# EAGLE design SparkFun_Thing_Plus_RP2350 (EAGLE 9.6.2)
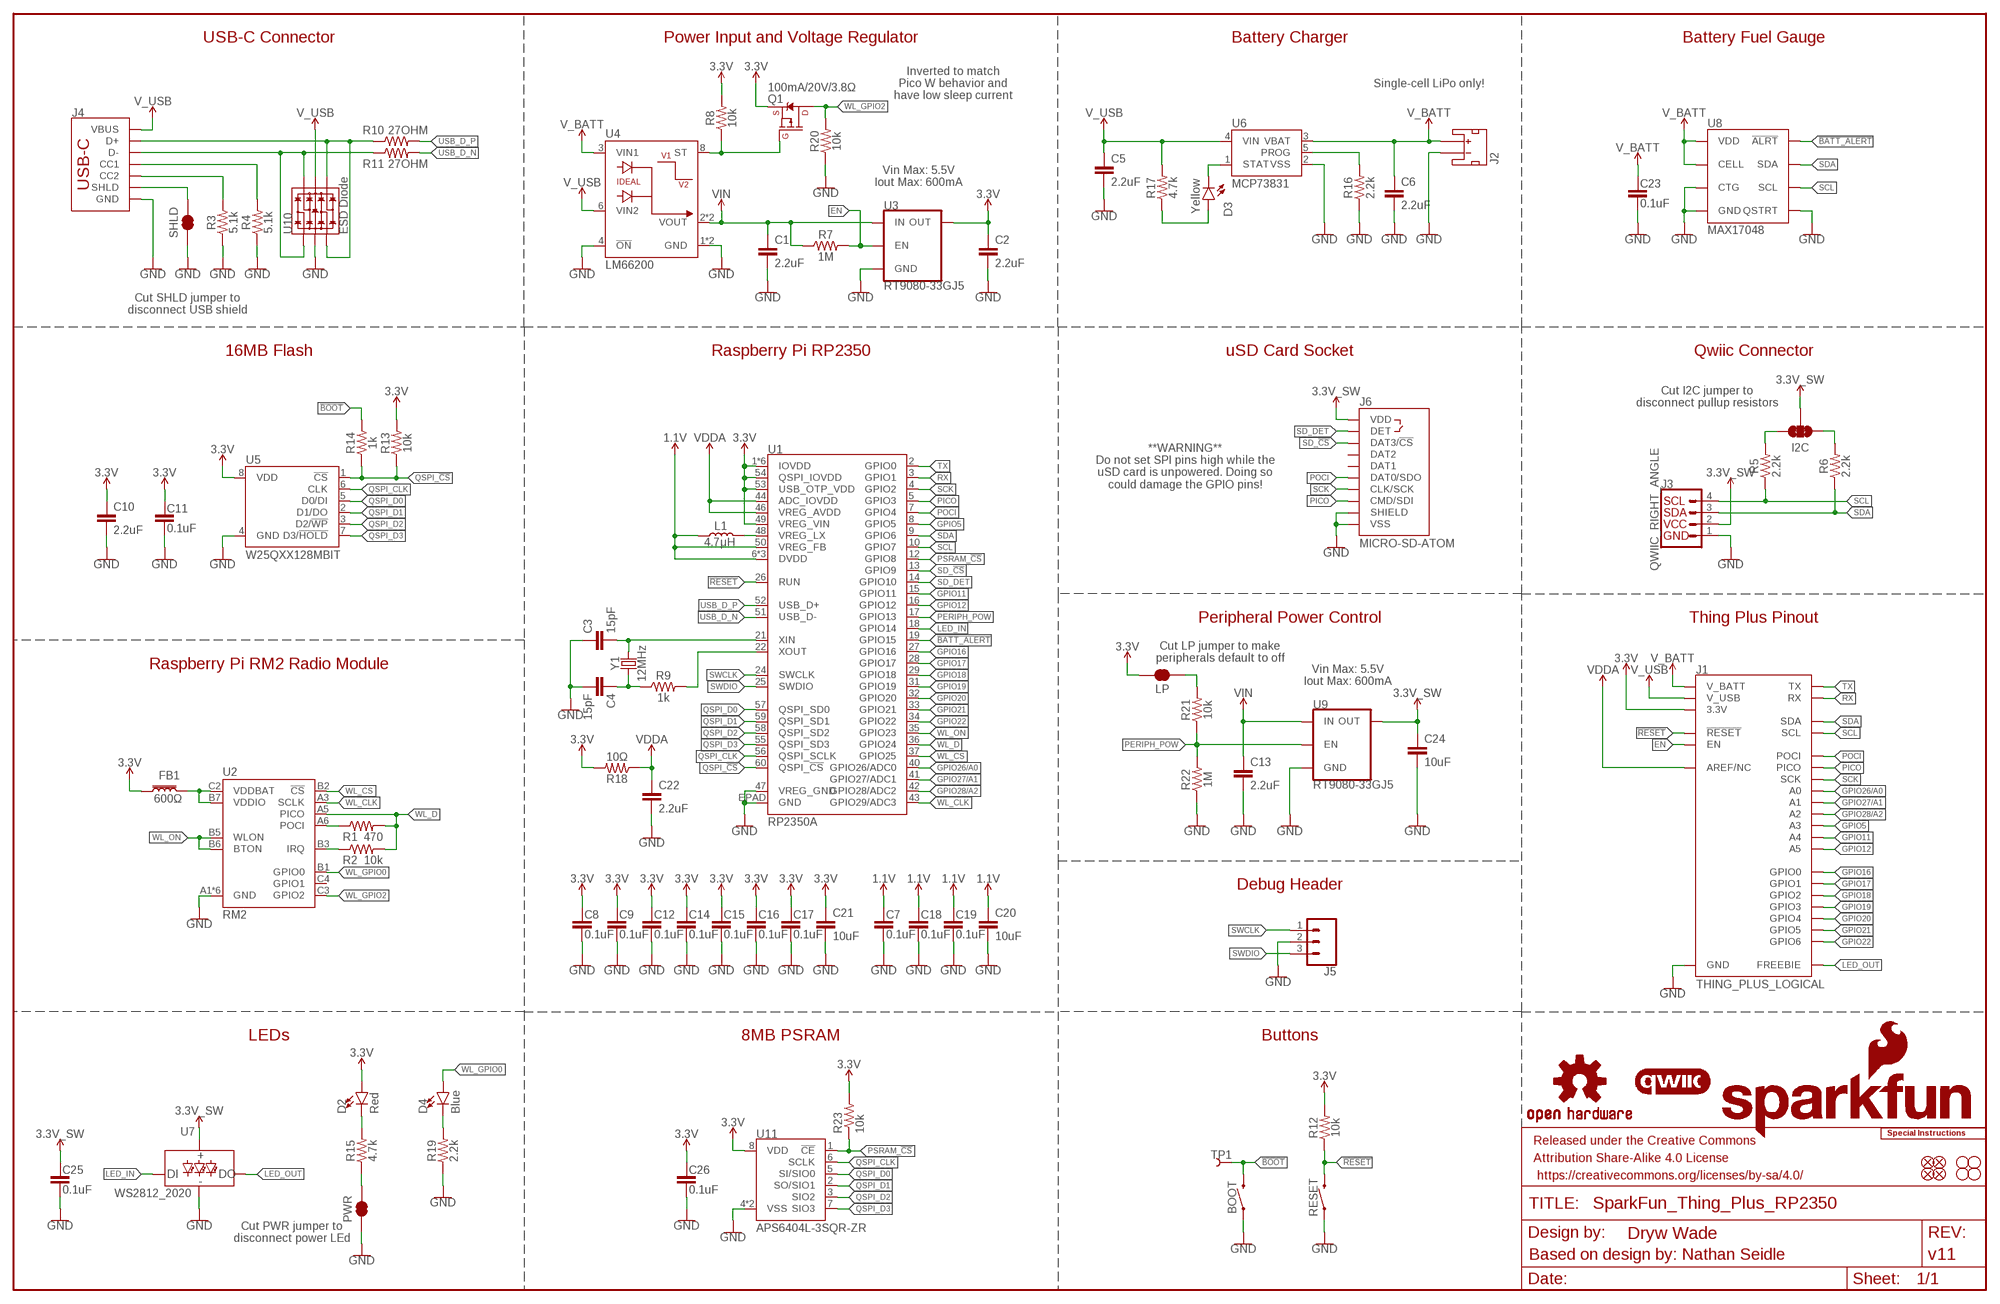
[diagram p0: schematic, sheet 1]

## Parts
BOOT  MOMENTARY-SWITCH-SPST-SMD-4.6X2.8MM  [TACTILE_SWITCH_SMD_4.6X2.8MM]
C1  2.2uF  2.2UF-0402_TIGHT-10V-10%-X5R  [0402-TIGHT]
C2  2.2uF  2.2UF-0402_TIGHT-10V-10%-X5R  [0402-TIGHT]
C3  15pF  15PF-0402T-50V-5%  [0402-TIGHT]
C4  15pF  15PF-0402T-50V-5%  [0402-TIGHT]
C5  2.2uF  2.2UF-0402_TIGHT-10V-10%-X5R  [0402-TIGHT]
C6  2.2uF  2.2UF-0402_TIGHT-10V-10%-X5R  [0402-TIGHT]
C7  0.1uF  0.1UF-0402T-6.3V-10%-X7R  [0402-TIGHT]
C8  0.1uF  0.1UF-0402T-6.3V-10%-X7R  [0402-TIGHT]
C9  0.1uF  0.1UF-0402T-6.3V-10%-X7R  [0402-TIGHT]
C10  2.2uF  2.2UF-0402_TIGHT-10V-10%-X5R  [0402-TIGHT]
C11  0.1uF  0.1UF-0402T-6.3V-10%-X7R  [0402-TIGHT]
C12  0.1uF  0.1UF-0402T-6.3V-10%-X7R  [0402-TIGHT]
C13  2.2uF  2.2UF-0402_TIGHT-10V-10%-X5R  [0402-TIGHT]
C14  0.1uF  0.1UF-0402T-6.3V-10%-X7R  [0402-TIGHT]
C15  0.1uF  0.1UF-0402T-6.3V-10%-X7R  [0402-TIGHT]
C16  0.1uF  0.1UF-0402T-6.3V-10%-X7R  [0402-TIGHT]
C17  0.1uF  0.1UF-0402T-6.3V-10%-X7R  [0402-TIGHT]
C18  0.1uF  0.1UF-0402T-6.3V-10%-X7R  [0402-TIGHT]
C19  0.1uF  0.1UF-0402T-6.3V-10%-X7R  [0402-TIGHT]
C20  10uF  10UF-0402T-6.3V-20%  [0402-TIGHT]
C21  10uF  10UF-0402T-6.3V-20%  [0402-TIGHT]
C22  2.2uF  2.2UF-0402_TIGHT-10V-10%-X5R  [0402-TIGHT]
C23  0.1uF  0.1UF-0402T-6.3V-10%-X7R  [0402-TIGHT]
C24  10uF  10UF-0402T-6.3V-20%  [0402-TIGHT]
C25  0.1uF  0.1UF-0402T-6.3V-10%-X7R  [0402-TIGHT]
C26  0.1uF  0.1UF-0402T-6.3V-10%-X7R  [0402-TIGHT]
D2  Red  LED-RED_0603-KB  [LED-0603]
D3  Yellow  LED-YELLOW0603  [LED-0603]
D4  Blue  LED-BLUE0603  [LED-0603]
FB1  600Ω  FERRITE_BEAD-0805-600Ω-100MHZ  [0805]
FD1  FIDUCIALUFIDUCIAL  [FIDUCIAL-MICRO]
FD2  FIDUCIALUFIDUCIAL  [FIDUCIAL-MICRO]
FD3  FIDUCIALUFIDUCIAL  [FIDUCIAL-MICRO]
FD4  FIDUCIALUFIDUCIAL  [FIDUCIAL-MICRO]
FRAME1  FRAME-LEDGER  [CREATIVE_COMMONS]
H1  STAND-OFF  [STAND-OFF]
H2  STAND-OFF  [STAND-OFF]
H3  STAND-OFF  [STAND-OFF]
H4  STAND-OFF  [STAND-OFF]
I2C  JUMPER-SMT_3_2-NC_TRACE_SILK  [SMT-JUMPER_3_2-NC_TRACE_SILK]
J1  THING_PLUS_LOGICAL  [THING_PLUS]
J2  JST_2MM_MALE  [JST-2-SMD]
J3  QWIIC_RIGHT_ANGLE  QWIIC_CONNECTORJS-1MM  [JST04_1MM_RA]
J4  USB_C_4-LAYER_PADS  [USB-C-16P_4LAYER-PADS]
J5  CONN_031X03_NO_SILK  [1X03_NO_SILK]
J6  MICRO-SD-ATOM  [MICROSD_ATOM]
L1  4.7μH  4.7μH_SHIELDED_INDUCTOR  [1008(2520)]
LOGO1  SFE_LOGO_NAME_FLAME.1_INCH  [SFE_LOGO_NAME_FLAME_.1]
LOGO2  OSHW-LOGOS  [OSHW-LOGO-S]
LOGO3  QWIIC_LOGO_4MM  [QWIIC_4MM]
LOGO5  SPECIAL_INSTRUCTIONS-ORDERING  [ORDERING_INSTRUCTIONS]
LP  JUMPER-SMT_2_NC_TRACE_SILK  [SMT-JUMPER_2_NC_TRACE_SILK]
PWR  JUMPER-SMT_2_NC_TRACE_SILK  [SMT-JUMPER_2_NC_TRACE_SILK]
Q1  100mA/20V/3.8Ω  MOSFET_PCH-RE1C001ZPTL  [SOT-416FL]
R1  470  470OHM-0402-TIGHT-1/16W-1%  [0402-TIGHT]
R2  10k  10KOHM-0402T-1/16W-1%  [0402-TIGHT]
R3  5.1k  5.1KOHM-0402T-1/16W-1%  [0402-TIGHT]
R4  5.1k  5.1KOHM-0402T-1/16W-1%  [0402-TIGHT]
R5  2.2k  2.2KOHM-0402T-1/16W-1%  [0402-TIGHT]
R6  2.2k  2.2KOHM-0402T-1/16W-1%  [0402-TIGHT]
R7  1M  1MOHM-0402T-1/16W-5%  [0402-TIGHT]
R8  10k  10KOHM-0402T-1/16W-1%  [0402-TIGHT]
R9  1k  1KOHM-0402T-1/16W-1%  [0402-TIGHT]
R10  27OHM  [0402-TIGHT]
R11  27OHM  [0402-TIGHT]
R12  10k  10KOHM-0402T-1/16W-1%  [0402-TIGHT]
R13  10k  10KOHM-0402T-1/16W-1%  [0402-TIGHT]
R14  1k  1KOHM-0402T-1/16W-1%  [0402-TIGHT]
R15  4.7k  4.7KOHM-0402T-1/16W-1%  [0402-TIGHT]
R16  2.2k  2.2KOHM-0402T-1/16W-1%  [0402-TIGHT]
R17  4.7k  4.7KOHM-0402T-1/16W-1%  [0402-TIGHT]
R18  10Ω  10OHM-0402-1/16W-5%  [0402-TIGHT]
R19  2.2k  2.2KOHM-0402T-1/16W-1%  [0402-TIGHT]
R20  10k  10KOHM-0402T-1/16W-1%  [0402-TIGHT]
R21  10k  10KOHM-0402T-1/16W-1%  [0402-TIGHT]
R22  1M  1MOHM-0402T-1/16W-5%  [0402-TIGHT]
R23  10k  10KOHM-0402T-1/16W-1%  [0402-TIGHT]
RESET  MOMENTARY-SWITCH-SPST-SMD-4.6X2.8MM  [TACTILE_SWITCH_SMD_4.6X2.8MM]
SHLD  JUMPER-SMT_2_NC_TRACE_SILK  [SMT-JUMPER_2_NC_TRACE_SILK]
TP1  TEST-POINT3X5  [PAD.03X.05]
U1  RP2350A  [RP2350A]
U2  RM2  [RM2]
U3  RT9080-33GJ5  V_REG_RT9080-33GJ5  [SOT23-5]
U4  LM66200  IDEAL_DIODE_DUAL_LM66200  [SOT8]
U5  W25QXX128MBIT  W25QXX128MBIT-6X5-SKINNY_CENTER  [WSON-8-6X5-SKINNY_CENTERPAD]
U6  MCP73831  [SOT23-5]
U7  WS2812_2020  [WS2812-2020]
U8  MAX17048  MAX17048DFN8  [DFN-8]
U9  RT9080-33GJ5  V_REG_RT9080-33GJ5  [SOT23-5]
U10  ESD Diode  TVS_DIODE_ARRAY_DT1042-04SO-7  [SOT-23-6]
U11  APS6404L-3SQR-ZR  [APS6404L-3SQR-ZR]
Y1  12MHz  CRYSTAL-12MHZ  [CRYSTAL-SMD-2X2.5MM]

## Nets
1.1V: C7.1 C18.1 C19.1 C20.1 L1.1 U1.6(DVDD) U1.23(DVDD) U1.39(DVDD) U1.50(VREG_FB)
3.3V: C2.1 C8.1 C9.1 C10.1 C11.1 C12.1 C14.1 C15.1 C16.1 C17.1 C21.1 C26.1 D2.A FB1.1 J1.27(3.3V) LP.2 Q1.2(S) R8.2 R12.2 R13.2 R18.2 R23.2 U1.1(IOVDD) U1.11(IOVDD) U1.20(IOVDD) U1.30(IOVDD) U1.38(IOVDD) U1.45(IOVDD) U1.49(VREG_VIN) U1.53(USB_OTP_VDD) U1.54(QSPI_IOVDD) U3.5(OUT) U5.8(VDD) U11.8(VDD)
3.3V_SW: C24.1 C25.1 I2C.2 J3.2 J6.4(VDD) U7.VCC U9.5(OUT)
!BATT_ALERT!: U1.19(GPIO15) U8.5(!ALRT)
!BOOT!: BOOT.3 BOOT.4 R14.2 TP1.1
!RESET!: J1.28(!RESET) R12.1 RESET.3 RESET.4 U1.26(RUN)
BAT_SW: Q1.1(G) R8.1 U4.8(ST)
EN: J1.11(EN) R7.2 U3.3(EN)
GND: BOOT.1 BOOT.2 C1.2 C2.2 C3.1 C4.2 C5.2 C6.2 C7.2 C8.2 C9.2 C10.2 C11.2 C12.2 C13.2 C14.2 C15.2 C16.2 C17.2 C18.2 C19.2 C20.2 C21.2 C22.2 C23.2 C24.2 C25.2 C26.2 J1.25(GND) J2.1(-) J3.1 J4.GND J4.GND2(GND) J5.2 J6.6(VSS) J6.SHIELD1(SHIELD) J6.SHIELD2(SHIELD) J6.SHIELD3(SHIELD) J6.SHIELD4(SHIELD) PWR.1 R3.1 R4.1 R16.1 R19.1 R20.1 R22.1 RESET.1 RESET.2 SHLD.1 U1.47(VREG_GND) U1.EPAD(GND) U2.A1(GND) U2.A4(GND) U2.A7(GND) U2.B4(GND) U2.C1(GND) U2.C7(GND) U3.2(GND) U4.1(GND) U4.4(!ON!) U4.5(GND) U5.4(GND) U6.2(VSS) U7.GND U8.1(CTG) U8.4(GND) U8.6(QSTRT) U8.9(GND) U9.2(GND) U10.2(VSS) U11.4(VSS) U11.9(VSS)
GPIO5: J1.21(A3) U1.8(GPIO5)
GPIO11: J1.20(A4) U1.15(GPIO11)
GPIO12: J1.19(A5) U1.16(GPIO12)
GPIO16: J1.9(GPIO0) U1.27(GPIO16)
GPIO17: J1.8(GPIO1) U1.28(GPIO17)
GPIO18: J1.7(GPIO2) U1.29(GPIO18)
GPIO19: J1.6(GPIO3) U1.31(GPIO19)
GPIO20: J1.5(GPIO4) U1.32(GPIO20)
GPIO21: J1.4(GPIO5) U1.33(GPIO21)
GPIO22: J1.3(GPIO6) U1.34(GPIO22)
GPIO26/A0: J1.24(A0) U1.40(GPIO26/ADC0)
GPIO27/A1: J1.23(A1) U1.41(GPIO27/ADC1)
GPIO28/A2: J1.22(A2) U1.42(GPIO28/ADC2)
LED_IN: U1.18(GPIO14) U7.DI
LED_OUT: J1.13(FREEBIE) U7.DO
N$1: FB1.2 U2.B7(VDDIO) U2.C2(VDDBAT)
N$2: R1.1 U2.A6(POCI)
N$3: R2.1 U2.B3(IRQ)
N$4: D4.C R19.2
N$5: J4.B5(CC2) R3.2
N$6: J4.A5(CC1) R4.2
N$7: J4.A7(D-) J4.B7(D-) R11.1 U10.1(IO1) U10.6(IO4)
N$8: J4.A6(D+) J4.B6(D+) R10.1 U10.3(IO2) U10.4(IO3)
N$9: I2C.3 R5.2
N$10: I2C.1 R6.2
N$11: LP.1 R21.2
N$13: C3.2 U1.21(XIN) Y1.P3
N$14: C4.1 R9.1 Y1.P1
N$15: R9.2 U1.22(XOUT)
N$18: D2.C R15.2
N$19: PWR.2 R15.1
N$20: R16.2 U6.5(PROG)
N$21: D3.A R17.1
N$22: D3.C U6.1(STAT)
N$23: L1.2 U1.48(VREG_LX)
PERIPH_POW: R21.1 R22.2 U1.17(GPIO13) U9.3(EN)
PICO: J1.17(PICO) J6.3(CMD/SDI) U1.5(GPIO3)
POCI: J1.16(POCI) J6.7(DAT0/SDO) U1.7(GPIO4)
PSRAM_!CS!: R23.1 U1.12(GPIO8) U11.1(!CE!)
QSPI_!CS!: R13.1 R14.1 U1.60(QSPI_!CS!) U5.1(!CS!)
QSPI_CLK: U1.56(QSPI_SCLK) U5.6(CLK) U11.6(SCLK)
QSPI_D0: U1.57(QSPI_SD0) U5.5(D0/DI) U11.5(SI/SIO0)
QSPI_D1: U1.59(QSPI_SD1) U5.2(D1/DO) U11.2(SO/SIO1)
QSPI_D2: U1.58(QSPI_SD2) U5.3(D2/!WP!) U11.3(SIO2)
QSPI_D3: U1.55(QSPI_SD3) U5.7(D3/!HOLD!) U11.7(SIO3)
RX: J1.15(RX) U1.3(GPIO1)
SCK: J1.18(SCK) J6.5(CLK/SCK) U1.4(GPIO2)
SCL: J1.2(SCL) J3.4 R5.1 U1.10(GPIO7) U8.7(SCL)
SD_!CS!: J6.2(DAT3/!CS!) U1.13(GPIO9)
SD_DET: J6.9(DET) U1.14(GPIO10)
SDA: J1.1(SDA) J3.3 R6.1 U1.9(GPIO6) U8.8(SDA)
SHLD: J4.SHLD1(SHLD) J4.SHLD2(SHLD) J4.SHLD3(SHLD) J4.SHLD4(SHLD) SHLD.2
SWCLK: J5.1 U1.24(SWCLK)
SWDIO: J5.3 U1.25(SWDIO)
TX: J1.14(TX) U1.2(GPIO0)
USB_D_N [USB]: R11.2 U1.51(USB_D-)
USB_D_P [USB]: R10.2 U1.52(USB_D+)
V_BATT: C6.1 C23.1 J1.12(V_BATT) J2.2(+) U4.3(VIN1) U6.3(VBAT) U8.2(CELL) U8.3(VDD)
V_USB: C5.1 J1.10(V_USB) J4.VBUS1(VBUS) J4.VBUS2(VBUS) R17.2 U4.6(VIN2) U6.4(VIN) U10.5(VCC)
VDDA: C22.1 J1.26(AREF/NC) R18.1 U1.44(ADC_IOVDD) U1.46(VREG_AVDD)
VIN: C1.1 C13.1 R7.1 U3.1(IN) U4.2(VOUT) U4.7(VOUT) U9.1(IN)
WL_CLK: U1.43(GPIO29/ADC3) U2.A3(SCLK)
WL_CS: U1.37(GPIO25) U2.B2(!CS!)
WL_D: R1.2 R2.2 U1.36(GPIO24) U2.A5(PICO)
WL_GPIO0: D4.A U2.B1(GPIO0)
WL_GPIO2: Q1.3(D) R20.2 U2.C3(GPIO2)
WL_ON: U1.35(GPIO23) U2.B5(WLON) U2.B6(BTON)
Unconnected: J2.NC1(PAD1) J2.NC2(PAD2) J6.1(DAT2) J6.8(DAT1) U2.C4(GPIO1)

## Notes on the sheet
- USB-C Connector | Power Input and Voltage Regulator | Battery Charger | Battery Fuel Gauge
- Inverted to match
  Pico W behavior and
  have low sleep current
- Single-cell LiPo only!
- Vin Max: 5.5V
  Iout Max: 600mA
- Cut SHLD jumper to
  disconnect USB shield
- 16MB Flash | Raspberry Pi RP2350 | uSD Card Socket | Qwiic Connector
- Cut I2C jumper to
  disconnect pullup resistors
- **WARNING**
  Do not set SPI pins high while the
  uSD card is unpowered. Doing so
  could damage the GPIO pins!
- Peripheral Power Control | Thing Plus Pinout
- Cut LP jumper to make
  peripherals default to off
- Raspberry Pi RM2 Radio Module
- Vin Max: 5.5V
  Iout Max: 600mA
- Debug Header
- LEDs | 8MB PSRAM | Buttons
- Cut PWR jumper to
  disconnect power LEd
- Based on design by: Nathan Seidle

## Library data of the parts
BOOT RESET = SparkFun-Switches:MOMENTARY-SWITCH-SPST: Momentary Switch (Pushbutton) - SPST Normally-open (NO) SPST momentary switches (buttons, pushbuttons). Variants PTH-12MM - 12mm square, through-hole Momentary Pushbutton Switch - 12mm Square <https://www.sparkfun.com/products/9190> (COM-09190) PTH-6.0MM, PTH-6.0MM-KIT - 6.0mm square, through-hole Mini Pushbutton Switch <https://www.sparkfun.com/products/97> (COM-00097) KIT package intended for soldering kit's - only one side of pads' copper is exposed. PTH-RIGHT-ANGLE-KIT - Right-angle, through-hole Right Angle Tactile Button <https://www.sparkfun.com/products/10791> - Used on SparkFun BigTime Watch Kit <https://www.sparkfun.com/products/11734> SMD-12MM - 12mm square, surface-mount Tactile Button - SMD (12mm) <https://www.sparkfun.com/products/12993> (COM-12993) Used on SparkFun PicoBoard <https://www.sparkfun.com/products/11888> SMD-4.5MM - 4.5mm Square Trackball Switch Used on SparkFun Blackberry Trackballer Breakout <https://www.sparkfun.com/products/13169> SMD-4.6MMX2.8MM - 4.60mm x 2.80mm, surface mount Used on SparkFun Thing Plus - RP2040 <https://www.sparkfun.com/products/17717> SMD-5.2MM, SMD-5.2-REDUNDANT - 5.2mm square, surface-mount Mini Pushbutton Switch - SMD <https://www.sparkfun.com/products/8720> (COM-08720) Used on Arduino Pro Mini <https://www.sparkfun.com/products/11114> REDUNDANT package connects both switch circuits together SMD-6.0X3.5MM - 6.0 x 3.5mm, surface mount Momentary Reset Switch SMD <https://www.sparkfun.com/products/8229> (COM-08229) SMD-6.2MM-TALL - 6.2mm square, surface mount Tactile Button - SMD (6mm) <https://www.sparkfun.com/products/12992> Used on SparkFun Digital Sandbox <https://www.sparkfun.com/products/12651> SMD-RIGHT-ANGLE - Right-angle, surface mount Used on SparkFun Block for Intel® Edison - Arduino <https://www.sparkfun.com/products/13036>; PROD_ID: SWCH-15606
C1 C2 C5 C6 C10 C13 C22 = SparkFun-Capacitors:2.2UF: 2.2µF ceramic capacitors A capacitor is a passive two-terminal electrical component used to store electrical energy temporarily in an electric field.; PROD_ID: CAP-14232
C3 C4 = SparkFun-Capacitors:15PF: 15pF ceramic capacitors A capacitor is a passive two-terminal electrical component used to store electrical energy temporarily in an electric field.; PROD_ID: CAP-13063
C7-C9 C11 C12 C14-C19 C23 C25 C26 = SparkFun-Capacitors:0.1UF: 0.1µF ceramic capacitors A capacitor is a passive two-terminal electrical component used to store electrical energy temporarily in an electric field.; PROD_ID: CAP-14993
C20 C21 C24 = SparkFun-Capacitors:10UF: 10.0µF ceramic capacitors A capacitor is a passive two-terminal electrical component used to store electrical energy temporarily in an electric field.; PROD_ID: CAP-14848
D2 = SparkFun-LED:LED-RED: Red SMD LED Used in manufacturing of most products at SparkFun Packages: 0603 - KB - KingBright (DIO-17976) SMD 0603 package [Datasheet] <https://www.kingbrightusa.com/images/catalog/SPEC/APT1608SURCK.pdf> 0603 - (DIO-00819, has gone EOL) SMD 0603 package 0603 SMART - SMD 0603 SMART package ( more efficient and expensive)[Product Link] <http://www.osram-os.com/Graphics/XPic2/00077099_0.pdf> 1206 - SMD1206 package [Product Link] <https://www.sparkfun.com/datasheets/DevTools/LilyPad/Q150OVS4.pdff> SparkFun Products: Pro Mini 328 -5V <https://www.sparkfun.com/products/821> RedBoard <https://www.sparkfun.com/products/12757> IOIO-OTG <https://www.sparkfun.com/products/13613>; PROD_ID: DIO-17976
D3 = SparkFun-LED:LED-YELLOW: Yellow SMD LED Used in manufacturing several products at SparkFun. Packages: 0603 - SMD 0603 package[Product Link] <http://www.kingbrightusa.com/product.asp?catalog_name=LED&product_id=APT1608SYCK> 0603 -SMART - SMART SMD 0603 package (more efficient/more expensive) [Product Link] <http://www.osram-os.com/osram_os/en/products/product-catalog/led-light-emitting-diodes/smartled-0603/ly-l29k/index.jsp> LilyPad - SMD1206 package[Product Datasheet] <https://www.sparkfun.com/datasheets/DevTools/LilyPad/Q150YUS4.pdf> SparkFun Products: Blynk Board <https://www.sparkfun.com/products/13794> IOIO-OTG <https://www.sparkfun.com/products/13613> XBee Explorer Serial <https://www.sparkfun.com/products/13225>; PROD_ID: DIO-09003
D4 = SparkFun-LED:LED-BLUE: Blue SMD LED Used in manufacturing of various products at SparkFun Packages: 0603 - SMD 0603 package [Product Link] <http://www.digikey.com/product-detail/en/SMLE12BC7TT86/511-1589-2-ND/1641808> 1206 - SMD1206 package [Product Link] <http://www.digikey.com/product-detail/en/lite-on-inc/LTST-C150TBKT/160-1643-1-ND/573584> SparkFun Products: ESP8266 Thing-Dev Board <https://www.sparkfun.com/products/13711> RedBoard <https://www.sparkfun.com/products/12757>; PROD_ID: DIO-08575
FB1 = SparkFun-Coils:FERRITE_BEAD: Ferrite Bead (blocks, cores, rings, chokes, etc.) Inductor with layers of ferrite used to suppress high frequencies. Often used to isolate high frequency noise. SparkFun Products: IOIO-OTG - V2.2 <https://www.sparkfun.com/products/13613> SparkFun SAMD21 Mini Breakout <https://www.sparkfun.com/products/13664> SparkFun 6 Degrees of Freedom Breakout - LSM6DS3 <https://www.sparkfun.com/products/13339> SparkFun SAMD21 Dev Breakout <https://www.sparkfun.com/products/13672> Lilypad MP3 <https://www.sparkfun.com/products/11013>; PROD_ID: NDUC-14988
FD1-FD4 = SparkFun-Aesthetics:FIDUCIAL: Fiducial Alignment Points Point-of-reference for pick-and-place machines and other optical instruments.
FRAME1 = SparkFun-Aesthetics:FRAME-LEDGER: Schematic Frame - Ledger Standard 11x14 US Ledger frame; DESIGNER: Dryw Wade; REV: v11
H1-H4 = SparkFun-Hardware:STAND-OFF: Stand Off Drill holes for mechanically mounting via screws, standoffs, etc. Note: Use the keepout ring to avoid running the screw head into surrounding components. Variant Overviews STAND-OFF - Mechanical footprint for a #4 phillips button head screw. STAND-OFF-TIGHT - Mechanical footprint for a #4 phillips button head screw, Example SparkFun Products Screw - Phillips Head (1/4", 4-40, 10 pack) <https://www.sparkfun.com/products/10453> (PRT-10453) Screw - Phillips Head (1/2", 4-40, 10 pack) <https://www.sparkfun.com/products/10452> (PRT-10452) Screw - Phillips Head (3/4", 4-40, 10 pack) <https://www.sparkfun.com/products/10451> (PRT-10451) Screw - Phillips Head (1", 4-40, 10 pack) <https://www.sparkfun.com/products/10450> (PRT-10450)
I2C = SparkFun-Jumpers:JUMPER-SMT_3_2-NC_TRACE: Normally closed trace jumper (2 of 2 connections) This jumper has a trace between all three pads so they are normally closed (NC). Use a razor knife to open the connection(s). For best results follow the IPC guidelines for cutting traces: Cutout at least 0.063 mm (0.005 in). Remove all loose material to clean up the cut area. Seal the cut with an approved epoxy. Reapply solder to reclose the connection(s).
J1 = SparkFun-Boards:THING_PLUS_LOGICAL
J2 = SparkFun-Connectors:JST_2MM_MALE: JST 2MM MALE RA CONNECTOR Two pin, compact surface mount connector. Commonly used as a battery input connection point. We really like the solid locking feeling and high current rating on these small connectors. We use these all the time as battery connectors. Mates to single-cell LiPo batteries. Here is the connector we sell at SparkFun: JST Right Angle Connector - White <https://www.sparkfun.com/products/8612> (PRT-08612) Datasheet <http://www.sparkfun.com/datasheets/Prototyping/Connectors/JST-Horizontal.pdf> It was used on these SparkFun products: SparkFun MOSFET Power Controller <https://www.sparkfun.com/products/11214> (PRT-11214) SparkFun Battery Babysitter - LiPo Battery Manager <https://www.sparkfun.com/products/13777> (PRT-13777) And many, many others that required a lipo battery connection.; PROD_ID: CONN-11443; SF_ID: PRT-08612
J3 = SparkFun-Connectors:QWIIC_CONNECTOR: SparkFun I2C Standard Qwiic Connector An SMD 1mm pitch JST connector makes it easy and quick (get it? Qwiic?) to connect I2C devices to each other. The Qwiic system <http://www.sparkfun.com/qwiic> enables fast and solderless connection between popular platforms and various sensors and actuators. We carry 200mm <https://www.sparkfun.com/products/14204>, 100mm <https://www.sparkfun.com/products/14205>, 50mm <https://www.sparkfun.com/products/14206>, and breadboard friendly <https://www.sparkfun.com/products/14207> Qwiic cables. We also offer 10 pcs strips <https://www.sparkfun.com/products/14323> the SMD connectors.; PROD_ID: CONN-13694
J4 = SparkFun-Connectors:USB_C: USB Type C 16Pin Connector Super Speed pins not available on the 16-pin purely SMD connector so this part is best for USB 2.0 implementations. D1 and D2 are tied together enabling D+/- no matter which way the cable is plugged into the connector. The two channel configuration pins (CC1/2) are exposed. These are normally connected to ground via 5.1k resistors but can be reconfigured for high current/high power applications. **4-LAYER BOARD WARNING!!** If designing 4-layer board, make sure to select the variant _4-LAYER-ISOLATED. The linked footprint (USB-C-16-4LAYER-ISOLATED) includes some very necessary cutout polygons in the inner layers (2 and 15). This prevents the PTH mounting shield legs on the USB connector from electrically connecting any other polygons on the inner layers (usually VCC and GND).; PROD_ID: CONN-14122
J5 = SparkFun-Connectors:CONN_03: Multi connection point. Often used as Generic Header-pin footprint for 0.1 inch spaced/style header connections On any of the 0.1 inch spaced packages, you can populate with these: Break Away Headers - Straight <https://www.sparkfun.com/products/116> (PRT-00116) Break Away Male Headers - Right Angle <https://www.sparkfun.com/products/553> (PRT-00553) Female Headers <https://www.sparkfun.com/products/115> (PRT-00115) Break Away Headers - Machine Pin <https://www.sparkfun.com/products/117> (PRT-00117) Break Away Female Headers - Swiss Machine Pin <https://www.sparkfun.com/products/743> (PRT-00743) Stackable Header - 3 Pin (Female, 0.1") <https://www.sparkfun.com/products/13875> (PRT-13875) For SCREWTERMINALS and SPRING TERMINALS visit here: Screw Terimnals on SparkFun.com <https://www.sparkfun.com/search/results?term=Screw+Terminals> (5mm/3.5mm/2.54mm spacing) This device is also useful as a general connection point to wire up your design to another part of your project. Our various solder wires solder well into these plated through hole pads. Hook-Up Wire - Assortment (Stranded, 22 AWG) <https://www.sparkfun.com/products/11375> (PRT-11375) Hook-Up Wire - Assortment (Solid Core, 22 AWG) <https://www.sparkfun.com/products/11367> (PRT-11367) View the entire wire category on our website here <https://www.sparkfun.com/categories/141> Special notes: Molex polarized connector foot print use with SKU : PRT-08232 with associated crimp pins and housings.
J6 = SparkFun-Connectors:MICRO-SD-ATOM; PROD_ID: CONN-20948
L1 = SparkFun-Coils:4.7μH_SHIELDED_INDUCTOR: 4.7uH Inductor 4.7uH 1.4A 50mOhm 1008(2520) Package Shielded; PROD_ID: NDUC-14880
LOGO1 = SparkFun-Aesthetics:SFE_LOGO_NAME_FLAME: SparkFun Font Logo w/ Flame This is the SparkFun full logo. The logo on the schematic will always be the same size; the package variant is the height of the flame part of the logo. Default layer for the logo on the board is tSilk.
LOGO2 = SparkFun-Aesthetics:OSHW-LOGO: Open-Source Hardware (OSHW) Logo This logo indicates the piece of hardware it is found on incorporates a OSHW license and/or adheres to the definition of open source hardware found here: http://freedomdefined.org/OSHW
LOGO3 = SparkFun-Aesthetics:QWIIC_LOGO: Qwiic Logos for placement on schematic and PCB. The 5.5mm silk logo is best for placing next to Qwiic connector.
LOGO5 = SparkFun-Aesthetics:SPECIAL_INSTRUCTIONS: Special Ordering/Production Instructions Alert Symbol for special PCB ordering instructions or unique production process warnings. Ordering Instructions Production Instructions Types of information that should be added to box: Copper weight Soldermask color Silk color PCB thickness Number of layers PCB Standard: 1.6mm FR4 1 oz copper immersion silver plating red soldermask white silkscreen Types of information that should be added to box: Special wash requirements Depaneling instructions Humidification Glue curing Default text settings: 0.07 inch 9% ratio 50% line distance
LP PWR SHLD = SparkFun-Jumpers:JUMPER-SMT_2_NC_TRACE: Normally closed trace jumper This jumper has a trace between two pads so it's normally closed (NC). Use a razor knife to open the connection. For best results follow the IPC guidelines for cutting traces: Cutout at least 0.063 mm (0.005 in). Remove all loose material to clean up the cut area. Seal the cut with an approved epoxy. Reapply solder to reclose the connection.
Q1 = SparkFun-DiscreteSemi:MOSFET_PCH: P-channel MOSFETs Voltage controlled devices that allow control of high current outputs. SparkFun Products: SparkFun ESP32 Thing <https://www.sparkfun.com/products/13907> SparkFun ESP8266 Thing <https://www.sparkfun.com/products/13231> SparkFun Pi Servo HAT V2 <https://www.sparkfun.com/products/15316> DMG2305UX-7 (20V/4.2A/SOT23-3); PROD_ID: TRANS-15421
R1 = SparkFun-Resistors:470OHM: 470Ω resistor A resistor is a passive two-terminal electrical component that implements electrical resistance as a circuit element. Resistors act to reduce current flow, and, at the same time, act to lower voltage levels within circuits. - Wikipedia; PROD_ID: RES-15584
R2 R8 R12 R13 R20 R21 R23 = SparkFun-Resistors:10KOHM: 10kΩ resistor A resistor is a passive two-terminal electrical component that implements electrical resistance as a circuit element. Resistors act to reduce current flow, and, at the same time, act to lower voltage levels within circuits. - Wikipedia; PROD_ID: RES-14241
R3 R4 = SparkFun-Resistors:5.1KOHM; PROD_ID: RES-14340
R5 R6 R16 R19 = SparkFun-Resistors:2.2KOHM: 2.2kΩ resistor A resistor is a passive two-terminal electrical component that implements electrical resistance as a circuit element. Resistors act to reduce current flow, and, at the same time, act to lower voltage levels within circuits. - Wikipedia; PROD_ID: RES-14341
R7 R22 = SparkFun-Resistors:1MOHM: 1MΩ resistor A resistor is a passive two-terminal electrical component that implements electrical resistance as a circuit element. Resistors act to reduce current flow, and, at the same time, act to lower voltage levels within circuits. - Wikipedia; PROD_ID: RES-15185
R9 R14 = SparkFun-Resistors:1KOHM: 1kΩ resistor A resistor is a passive two-terminal electrical component that implements electrical resistance as a circuit element. Resistors act to reduce current flow, and, at the same time, act to lower voltage levels within circuits. - Wikipedia; PROD_ID: RES-14342
R10 R11 = SparkFun-Resistors:27OHM: 27Ω resistor A resistor is a passive two-terminal electrical component that implements electrical resistance as a circuit element. Resistors act to reduce current flow, and, at the same time, act to lower voltage levels within circuits. - Wikipedia; PROD_ID: RES-15238
R15 R17 = SparkFun-Resistors:4.7KOHM: 4.7kΩ resistor A resistor is a passive two-terminal electrical component that implements electrical resistance as a circuit element. Resistors act to reduce current flow, and, at the same time, act to lower voltage levels within circuits. - Wikipedia; PROD_ID: RES-15343
R18 = SparkFun-Resistors:10OHM: 10Ω resistor A resistor is a passive two-terminal electrical component that implements electrical resistance as a circuit element. Resistors act to reduce current flow, and, at the same time, act to lower voltage levels within circuits. - Wikipedia; PROD_ID: RES-16072
TP1 = SparkFun-Connectors:TEST-POINT: SparkFun Test Points Bare copper test points for troubleshooting or In-Circuit-Testing. These are used by our Production team for verifying production board runs using pogo-pins on test beds. SparkFun Products: SparkFun LSM9DS1 Breakout <https://www.sparkfun.com/products/13284> SparkFun PSOC <https://www.sparkfun.com/products/13714> SparkFun Load Cell Amplifier <https://www.sparkfun.com/products/13879>
U1 = RP2350A:RP2350A; PROD_ID: IC-21276
U2 = RM2:RM2; PROD_ID: IC-21607
U3 U9 = SparkFun-IC-Power:V_REG_RT9080-33GJ5: RT9080-33GJ5 Low-Dropout Linear Regulator The RT9080 is a low-dropout (LDO) voltage regulators with enable function that operates from 1.2V to 5.5V. It provides up to 600mA of output current and offers low-power operation in miniaturized packaging. The features of low quiescent current as low as 2μA and almost zero disable current is ideal for powering the battery equipment to a longer service life. The RT9080 is stable with the ceramic output capacitor over its wide input range from 1.2V to 5.5V and the entire range of output load current (0mA to 600mA). The output for this LDO is 3.3V.; PROD_ID: VREG-19034
U4 = SparkFun-IC-Power:IDEAL_DIODE_DUAL_LM66200; PROD_ID: IC-20783
U5 = SparkFun-IC-Memory:W25QXX; PROD_ID: IC-15107
U6 = SparkFun-IC-Power:MCP73831: MCP73831T Li-Ion, Li-Pol Controller Miniature single cell, fully integrated Li-Ion, Li-polymer charge management controller Datasheet <http://ww1.microchip.com/downloads/en/DeviceDoc/20001984g.pdf> SparkFun Products: SparkFun ESP32 Thing <https://www.sparkfun.com/products/13907> SparkFun 9DoF Razor IMU M0 <https://www.sparkfun.com/products/14001>; PROD_ID: IC-09995
U7 = SparkFun-LED:WS2812: Addressable RGB LED - 1 Wire Common names: WS2812, SK6812, Neopixel, APA-106, etc. SMD LED with built-in controller IC. Color: Red/Green/Blue SparkFun Products: LED-SMD RGB (WS2812) <https://www.sparkfun.com/products/12661> LED - RGB Addressable, PTH, 5mm Diffused (5 Pack) <https://www.sparkfun.com/products/12986> LED - RGB Addressable, PTH, 5mm Clear (5 Pack) <https://www.sparkfun.com/products/12999> RGB Addressable CBI LED 5mm RA <https://www.sparkfun.com/products/23649> Datasheet referenced for footprint: WS2812B-PTH <https://cdn.sparkfun.com/datasheets/Components/LED/COM-12877.pdf>; PROD_ID: DIO-15591
U8 = SparkFun-IC-Power:MAX17048: Micropower 1-Cell Li+ ModelGauge SparkFun Products Qduino Mini <https://www.sparkfun.com/products/13614> (DEV-13614); PROD_ID: IC-12551
U10 = SparkFun-DiscreteSemi:TVS_DIODE_ARRAY; PROD_ID: IC-13538
U11 = RP2350A:APS6404L-3SQR-ZR; PROD_ID: IC-21870
Y1 = SparkFun-Clocks:CRYSTAL-12MHZ: 12.0MHz Crystal Frequency: 12.0MHz Frequency Tolerance: ±20ppm Load Capacitance: 18pF SparkFun Products: SparkFun Logomatic <https://www.sparkfun.com/products/12772> Pocket AVR Programmer <https://www.sparkfun.com/products/9825>; PROD_ID: XTAL-15540

## Net classes
1 USB: width 0.233 mm, clearance 0.127 mm to class 0, clearance 0.127 mm

## Board
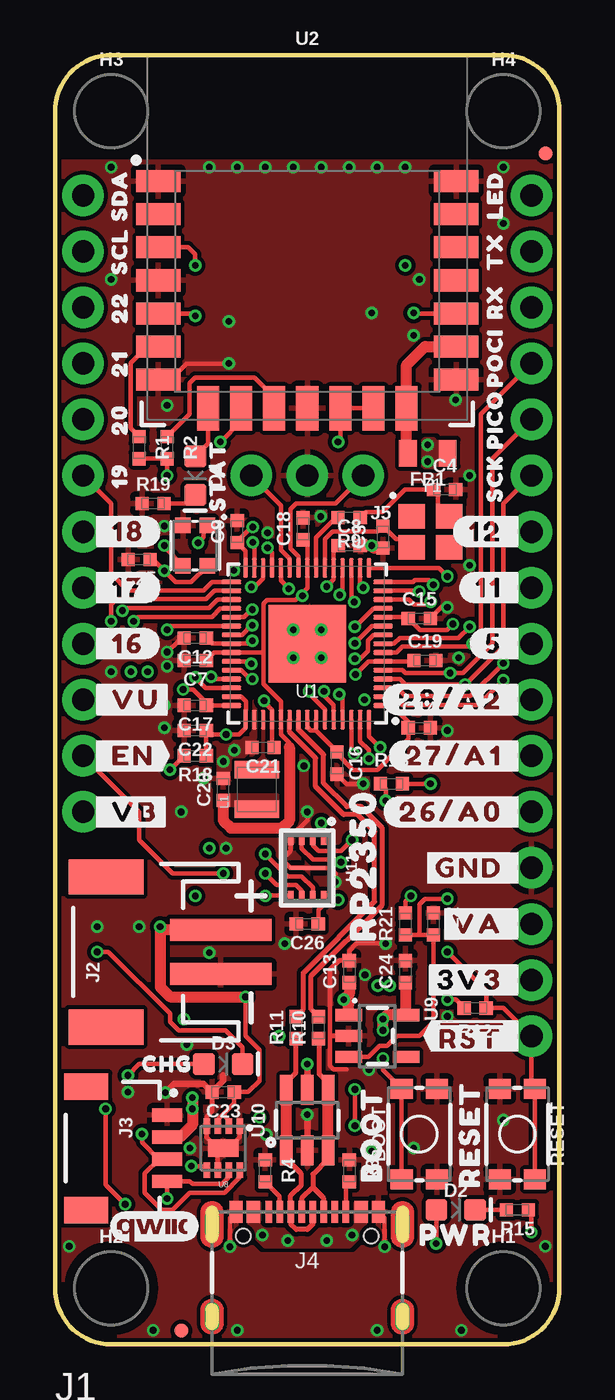
[diagram p1: board, top side]
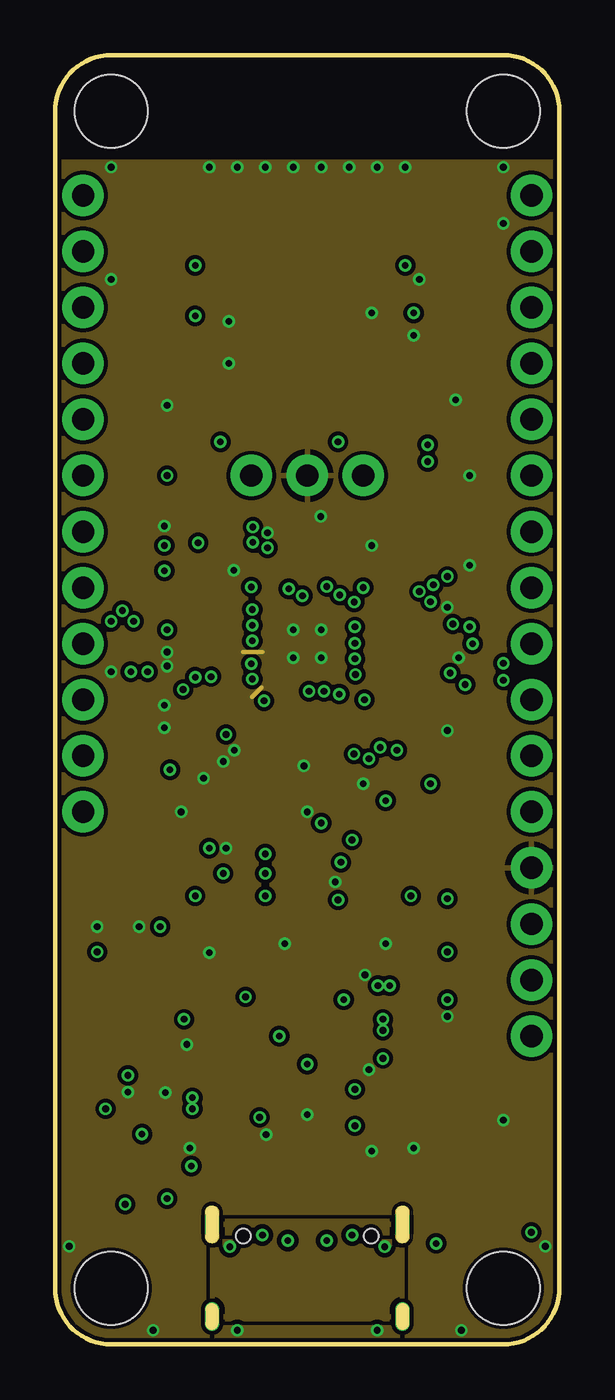
[diagram p2: board, inner layer Route2]
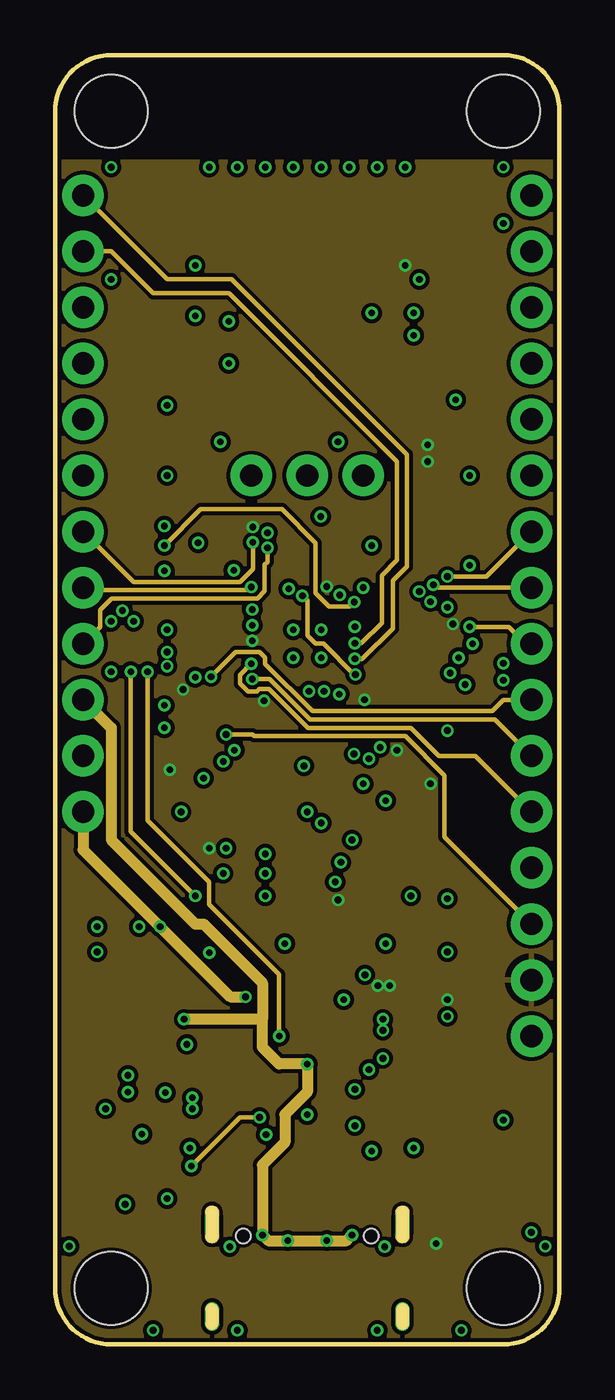
[diagram p3: board, inner layer Route15]
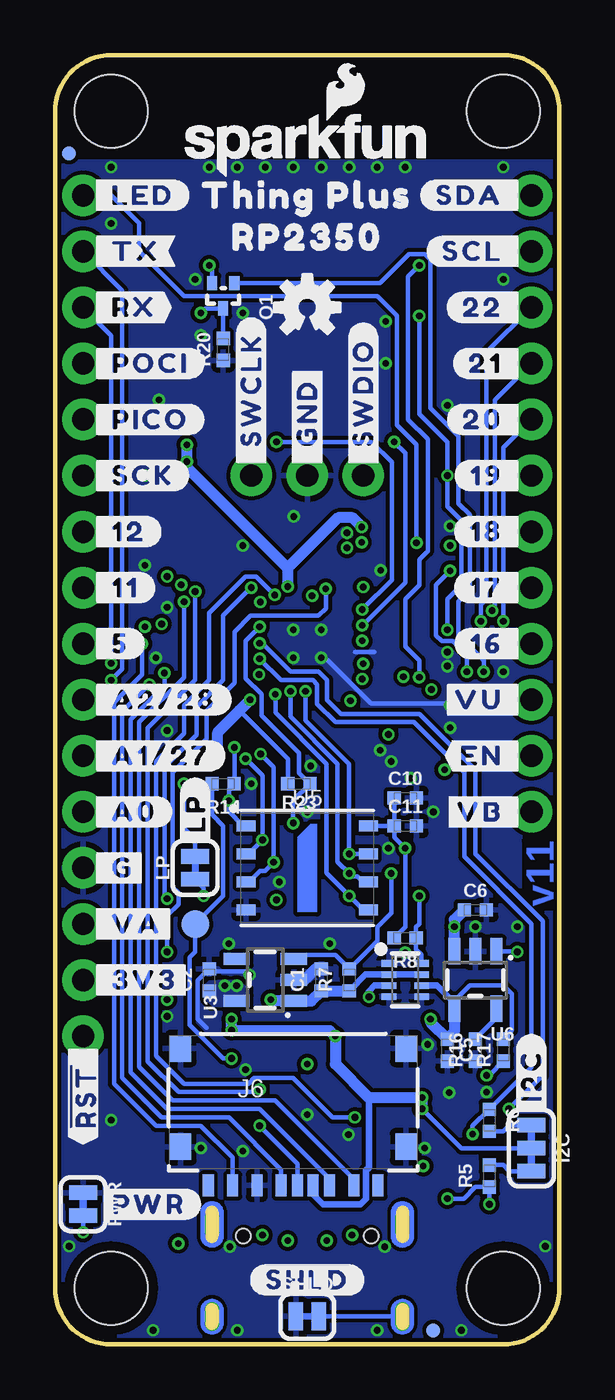
[diagram p4: board, bottom side, seen from below]

Size 22.86 x 58.42 mm. Coordinates in mm from the lower left corner, seen from the top.
Outline: 2.54,0 20.32,0 arc90 22.86,2.54 22.86,55.88 arc90 20.32,58.42 2.54,58.42 arc90 0,55.88 0,2.54 arc90 2.54,0
Copper layers (1*2*15*16): Top 0.035559375mm / dielectric 0.47751875mm / Route2 0.035559375mm / dielectric 0.47751875mm / Route15 0.035559375mm / dielectric 0.47751875mm / Bottom 0.035559375mm
Design rules "SparkFun-4-Layer-Minimum-JLCPCB": minimum track width 5mil, minimum drill 0.2mm, track to track 5mil, track to pad 5mil, pad to pad 5mil, via to via 5mil, smd to smd 5mil, copper to edge 7mil, drill to drill 7mil, minimum pad ring 5mil, minimum via ring 5mil, stop-mask expansion 2.5mil, vias tented up to drill 25mil, thermal gap 10mil

### Footprints (pad centres in the part's own frame; a part is rotated, then mirrored left to right if it is on the bottom)
TACTILE_SWITCH_SMD_4.6X2.8MM = smd 0.9 x 1: 1 -2.05,-0.8; 2 2.05,-0.8; 3 2.05,0.8; 4 -2.05,0.8
0402-TIGHT = smd 0.6 x 0.6: 1 -0.5,0; 2 0.5,0
LED-0603 = smd 1 x 1: A -0.877,0; C 0.877,0
0805 = smd 0.8 x 1.2: 1 -0.9,0; 2 0.9,0
FIDUCIAL-MICRO = smd 0.635 x 0.635: 1 0,0
STAND-OFF = hole 3.302: 0,0
SMT-JUMPER_3_2-NC_TRACE_SILK = smd 0.66 x 1.27: 1 -1.041,0; 2 0,0; 3 1.041,0
THING_PLUS = drill 1.016 pad 1.88: 1 1.27,52.07; 2 1.27,49.53; 3 1.27,46.99; 4 1.27,44.45; 5 1.27,41.91; 6 1.27,39.37; 7 1.27,36.83; 8 1.27,34.29; 9 1.27,31.75; 10 1.27,29.21; 11 1.27,26.67; 12 1.27,24.13; 13 21.59,52.07; 14 21.59,49.53; 15 21.59,46.99; 16 21.59,44.45; 17 21.59,41.91; 18 21.59,39.37; 19 21.59,36.83; 20 21.59,34.29; 21 21.59,31.75; 22 21.59,29.21; 23 21.59,26.67; 24 21.59,24.13; 25 21.59,21.59; 26 21.59,19.05; 27 21.59,16.51; 28 21.59,13.97
JST-2-SMD = smd 1 x 4.6: 1 -1,-3.7; 2 1,-3.7 | smd 1.6 x 3.4: NC1 -3.4,1.5; NC2 3.4,1.5
JST04_1MM_RA = smd 0.6 x 1.35: 1 -1.5,0; 2 -0.5,0; 3 0.5,0; 4 1.5,0 | smd 1.2 x 2: NC1 2.8,-3.675; NC2 -2.8,-3.675
USB-C-16P_4LAYER-PADS = smd 0.3 x 1: A5 -1.25,-0.34; A6 -0.25,-0.34; A7 0.25,-0.34; A8 1.25,-0.34; B5 1.75,-0.34; B6 0.75,-0.34; B7 -0.75,-0.34; B8 -1.75,-0.34 | smd 0.6 x 1: GND -3.225,-0.34; GND2 3.225,-0.34; VBUS1 -2.45,-0.34; VBUS2 2.45,-0.34 | drill 0.4 pad 0.6 long: SHLD1 -4.318,-0.915; SHLD2 4.318,-0.915; SHLD3 -4.318,-5.095; SHLD4 4.318,-5.095 | hole 0.65: -2.89,-1.445; 2.89,-1.445
1X03_NO_SILK = drill 1.016 pad 1.88: 1 0,0; 2 2.54,0; 3 5.08,0
MICROSD_ATOM = smd 0.5 x 1: 1 3.85,-3.975; 2 2.75,-3.975; 3 1.65,-3.975; 4 0.9,-3.975; 5 -0.55,-3.975; 6 -1.65,-3.975; 7 -2.75,-3.975; 8 -3.85,-3.975; 9 0.2,-3.975 | smd 0.95 x 1.2: SHIELD1 5.1,-2.225; SHIELD2 5.1,2.225; SHIELD3 -5.1,2.225; SHIELD4 -5.1,-2.225
1008(2520) = smd 0.8 x 2: 1 -0.9,0; 2 0.9,0
SMT-JUMPER_2_NC_TRACE_SILK = smd 0.66 x 1.27: 1 -0.521,0; 2 0.521,0
SOT-416FL = smd 0.46 x 0.65: 1 -0.5,-1.1; 2 0.5,-1.1; 3 0,0.05
PAD.03X.05 = smd 1.27 x 1.27: 1 0,0
RP2350A = smd 0.875 x 0.2: 1 -3.437,2.8; 2 -3.437,2.4; 3 -3.437,2; 4 -3.437,1.6; 5 -3.437,1.2; 6 -3.437,0.8; 7 -3.437,0.4; 8 -3.437,0; 9 -3.437,-0.4; 10 -3.437,-0.8; 11 -3.437,-1.2; 12 -3.437,-1.6; 13 -3.437,-2; 14 -3.437,-2.4; 15 -3.437,-2.8; 31 3.437,-2.8; 32 3.437,-2.4; 33 3.437,-2; 34 3.437,-1.6; 35 3.437,-1.2; 36 3.437,-0.8; 37 3.437,-0.4; 38 3.437,0; 39 3.437,0.4; 40 3.437,0.8; 41 3.437,1.2; 42 3.437,1.6; 43 3.437,2; 44 3.437,2.4; 45 3.437,2.8 | smd 0.2 x 0.875: 16 -2.8,-3.437; 17 -2.4,-3.437; 18 -2,-3.437; 19 -1.6,-3.437; 20 -1.2,-3.437; 21 -0.8,-3.437; 22 -0.4,-3.437; 23 0,-3.437; 24 0.4,-3.437; 25 0.8,-3.437; 26 1.2,-3.437; 27 1.6,-3.437; 28 2,-3.437; 29 2.4,-3.437; 30 2.8,-3.437; 46 2.8,3.437; 47 2.4,3.437; 48 2,3.437; 49 1.6,3.437; 50 1.2,3.437; 51 0.8,3.437; 52 0.4,3.437; 53 0,3.437; 54 -0.4,3.437; 55 -0.8,3.437; 56 -1.2,3.437; 57 -1.6,3.437; 58 -2,3.437; 59 -2.4,3.437; 60 -2.8,3.437 | smd 3.5 x 3.5: EPAD 0,0
RM2 = smd 2 x 1: A1 -6.75,2.55; A2 -6.75,1.05; A3 -6.75,-0.45; A4 -6.75,-1.95; A5 -6.75,-3.45; A6 -6.75,-4.95; A7 -6.75,-6.45; C1 6.75,-6.45; C2 6.75,-4.95; C3 6.75,-3.45; C4 6.75,-1.95; C5 6.75,-0.45; C6 6.75,1.05; C7 6.75,2.55 | smd 1 x 2: B1 -4.5,-7.75; B2 -3,-7.75; B3 -1.5,-7.75; B4 0,-7.75; B5 1.5,-7.75; B6 3,-7.75; B7 4.5,-7.75
SOT23-5 = smd 0.55 x 1.2: 1 -0.95,-1.3; 2 0,-1.3; 3 0.95,-1.3; 4 0.95,1.3; 5 -0.95,1.3
SOT8 = smd 0.67 x 0.3: 1 -0.74,0.75; 2 -0.74,0.25; 3 -0.74,-0.25; 4 -0.74,-0.75; 5 0.74,-0.75; 6 0.74,-0.25; 7 0.74,0.25; 8 0.74,0.75
WSON-8-6X5-SKINNY_CENTERPAD = smd 0.85 x 0.5: 1 -2.775,1.905; 2 -2.775,0.635; 3 -2.775,-0.635; 4 -2.775,-1.905; 5 2.775,-1.905; 6 2.775,-0.635; 7 2.775,0.635; 8 2.775,1.905
WS2812-2020 = smd 0.7 x 0.7: DI -0.915,0.55; DO 0.915,-0.55; GND 0.915,0.55; VCC -0.915,-0.55
DFN-8 = smd 0.3 x 0.7: 1 -0.75,-0.99; 2 -0.25,-0.99; 3 0.25,-0.99; 4 0.75,-0.99; 5 0.75,0.99; 6 0.25,0.99; 7 -0.25,0.99; 8 -0.75,0.99 | smd 1.38 x 0.8: 9 0,0
SOT-23-6 = smd 0.55 x 1.35: 1 -0.95,-1.375; 2 0,-1.375; 3 0.95,-1.375; 4 0.95,1.375; 5 0,1.375; 6 -0.95,1.375
APS6404L-3SQR-ZR = smd 0.4 x 0.25: 1 -1.25,0.75; 2 -1.25,0.25; 3 -1.25,-0.25; 4 -1.25,-0.75; 5 1.25,-0.75; 6 1.25,-0.25; 7 1.25,0.25; 8 1.25,0.75 | smd 0.2 x 1.6: 9 0,0
CRYSTAL-SMD-2X2.5MM = smd 1.2 x 1.1: P1 0.846,0.69; P2 -0.854,0.69; P3 -0.854,-0.71; P4 0.846,-0.71

### Placement (x,y rotation side)
BOOT  16.51,9.53 90 top
C1  10.79,16.52 90 bottom
C2  15.88,16.52 90 bottom
C3  14.86,36.58 90 top
C4  17.66,38.73 0 top
C5  5.08,13.34 270 bottom
C6  3.81,19.68 0 bottom
C7  6.35,30.99 180 top
C8  13.34,36.2 0 top
C9  8.26,36.83 90 top
C10  6.99,24.77 0 bottom
C11  6.99,23.5 0 bottom
C12  6.35,32 180 top
C13  13.34,16.89 90 top
C14  16.51,27.94 0 top
C15  16.51,32.89 0 top
C16  12.78,26.34 270 top
C17  6.35,28.96 180 top
C18  11.24,36.96 90 top
C19  16.76,30.99 0 top
C20  7.62,25.15 90 top
C21  9.42,27.05 180 top
C22  6.35,27.81 180 top
C23  7.62,11.43 180 top
C24  15.88,16.89 90 top
C25  3.81,35.56 180 top
C26  11.43,19.05 180 top
D2  18.16,6.1 0 top
D3  7.62,12.7 0 top
D4  6.35,39.37 270 top
FB1  16.89,40.39 180 top
FD1  22.23,53.98 0 top
FD2  22.23,53.98 0 bottom
FD3  5.71,0.64 0 top
FD4  5.71,0.64 0 bottom
FRAME1  66.04,-7.62 0 top  (outside the outline)
H1  20.32,2.54 0 top
H2  2.54,2.54 0 top
H3  2.54,55.88 0 top
H4  20.32,55.88 0 top
I2C  1.27,8.89 270 bottom
J1  0,0 0 top
J2  3.81,17.78 90 top
J3  5.08,8.89 270 top
J4  11.43,6.35 0 top
J5  13.97,39.37 180 top
J6  12.06,11.18 0 bottom
L1  9.14,25.15 90 top
LOGO1  11.43,54.36 0 bottom
LOGO2  11.43,46.99 0 bottom
LOGO3  4.51,5.33 0 top
LOGO5  38.1,50.8 0 top  (outside the outline)
LP  16.51,21.59 90 bottom
PWR  21.59,6.35 270 bottom
Q1  15.24,46.99 180 bottom
R1  3.81,40.63 270 top
R2  5.08,40.63 270 top
R3  13.34,7.87 270 top
R4  9.53,7.87 270 top
R5  3.17,7.63 90 bottom
R6  3.17,10.15 270 bottom
R7  9.53,16.52 90 bottom
R8  6.99,18.41 180 bottom
R9  13.33,37.47 180 top
R10  11.94,14.35 90 top
R11  10.92,14.35 90 top
R12  19.04,15.24 180 top
R13  15.25,25.4 0 top
R14  15.25,25.4 180 bottom
R15  20.95,6.1 180 top
R16  3.81,13.34 90 bottom
R17  2.54,13.34 90 bottom
R18  6.35,26.67 180 top
R19  4.45,38.1 0 top
R20  15.24,45.09 90 bottom
R21  15.88,19.05 90 top
R22  17.14,19.05 270 top
R23  11.81,25.4 180 bottom
RESET  20.95,9.53 270 top
SHLD  11.43,1.27 0 bottom
TP1  16.51,19.05 0 bottom
U1  11.43,31.75 180 top
U2  11.43,50.16 0 top
U3  13.34,16.51 90 bottom
U4  6.99,16.51 0 bottom
U5  11.43,21.59 0 bottom
U6  3.81,16.51 180 bottom
U7  6.35,36.2 90 top
U8  7.62,8.89 180 top
U9  14.61,13.97 270 top
U10  11.43,10.16 0 top
U11  11.43,21.59 270 top
U$1  [SDA0]  2.92,52.07 90 top
U$2  [SCL0]  2.92,49.53 90 top
U$3  [TX0]  19.94,49.53 90 top
U$4  [RX0]  19.94,47.24 90 top
U$5  [PICO0]  19.94,41.91 90 top
U$6  [POCI0]  19.94,44.7 90 top
U$7  [SCK0]  19.94,39.24 90 top
U$8  [#SDA_#0]  1.52,52.07 0 bottom
U$9  [#SCL_#0]  1.52,49.53 0 bottom
U$10  [#_TX#0]  21.34,49.53 0 bottom
U$11  [#_RX#0]  21.34,46.99 0 bottom
U$12  [#_POCI#0]  21.34,44.45 0 bottom
U$13  [#_PICO#0]  21.34,41.91 0 bottom
U$14  [#_SCK#0]  21.34,39.37 0 bottom
U$15  [#_GND#0]  11.43,39.62 90 bottom
U$16  [#_A0#0]  21.34,24.13 0 bottom
U$17  [#_3V3#0]  21.34,16.51 0 bottom
U$18  [##RST#_#0]  21.34,13.97 0 top
U$19  [#I2C#0]  1.27,10.29 90 bottom
U$20  [#_SWCLK#0]  13.97,39.62 90 bottom
U$21  [#_SWDIO#0]  8.89,39.62 90 bottom
U$22  [#_VB#0]  1.52,24.13 0 top
U$23  [#_VU#0]  1.52,29.21 0 top
U$24  [#_EN#0]  1.52,26.67 0 top
U$25  [#3V3_#0]  21.34,16.51 0 top
U$26  [#LP#0]  16.51,22.48 90 bottom
U$27  [#GND_#0]  21.34,21.59 0 top
U$28  [#11_#0]  21.34,34.29 0 top
U$29  [#26#A0_#0]  21.34,24.13 0 top
U$30  [#27#A1_#0]  21.34,26.67 0 top
U$31  [#28#A2_#0]  21.34,29.21 0 top
U$32  [BOOT0]  14.35,9.53 90 top
U$33  [RESET0]  18.8,9.53 90 top
U$34  [#VU_#0]  1.52,29.21 0 bottom
U$35  [#VB_#0]  1.52,24.13 0 bottom
U$36  [#EN_#0]  1.52,26.67 0 bottom
U$38  [#_A1#27#0]  21.34,26.67 0 bottom
U$39  [#_A2#28#0]  21.34,29.21 0 bottom
U$40  [#PWR#0]  20.95,6.35 0 bottom
U$41  [#SHLD#0]  11.43,2.92 0 bottom
U$42  [THING_PLUS0]  11.43,52.07 0 bottom
U$43  [RP23500]  11.43,50.16 0 bottom
U$44  [#_G#0]  21.34,21.59 0 bottom
U$45  [RP23500]  13.97,21.72 90 top
U$46  [#_16#0]  1.52,31.75 0 top
U$47  [#_17#0]  1.52,34.29 0 top
U$48  [#_18#0]  1.52,36.83 0 top
U$49  [CHG0]  5.08,12.7 0 top
U$50  [200]  2.92,41.91 90 top
U$51  [210]  2.92,44.45 90 top
U$52  [220]  2.92,46.99 90 top
U$53  [#22_#0]  1.52,46.99 0 bottom
U$54  [#21_#0]  1.52,44.45 0 bottom
U$55  [#20_#0]  1.52,41.91 0 bottom
U$56  [#19_#0]  1.52,39.37 0 bottom
U$57  [#18_#0]  1.52,36.83 0 bottom
U$58  [#17_#0]  1.52,34.29 0 bottom
U$59  [#16_#0]  1.52,31.75 0 bottom
U$60  [190]  2.92,39.37 90 top
U$61  [##RST#_#0]  21.59,13.72 90 bottom
U$62  [PWR0]  18.16,4.95 0 top
U$63  [STAT0]  7.37,39.37 90 top
U$64  [#5_#0]  21.34,31.75 0 top
U$65  [#12_#0]  21.34,36.83 0 top
U$66  [#_12#0]  21.34,36.83 0 bottom
U$67  [LED0]  19.94,52.07 90 top
U$68  [#_LED#0]  21.34,52.07 0 bottom
U$69  [#_5#0]  21.34,31.75 0 bottom
U$70  [#_11#0]  21.34,34.29 0 bottom
U$72  [#VA_#0]  21.34,19.05 0 top
U$73  [#_VA#0]  21.34,19.05 0 bottom
Y1  17.02,36.83 0 top

### Tracks (layer width: path | path; a pad name or v marks a point on that pad's centre or on a via)
1.1V  (via drill 0.3)
  Top 0.203: C7.1 7.21,31.35 U1.39 9.45,31.35 | C19.1 16.23,30.95 U1.6 14.21,30.95 v13.61,30.35 | C18.1 11.43,36.27 U1.23 11.43,34.27 11.21,34.05 v11.21,33.92 11.08,33.92 10.9,33.73 9.6,33.73 9.45,33.58 9.45,31.35 | 10.62,27.05 10.62,27.25 10.23,27.64 U1.50 10.23,29.14 9.45,29.92 9.45,31.35
  Top 0.508: C20.1 7.62,23.75 7.98,23.39 10.29,23.39 10.62,23.72 10.62,27.05
  Route15 0.203: v13.61,30.35 13.56,30.35 12.16,31.75 11.81,31.75 11.43,32.13 11.43,33.7 v11.21,33.92
  pour Top (isolate 0.127, no thermals): 10.11,23.95 10.11,24.89 7.42,24.89 7.42,24.41 8.28,24.41 8.28,23.95
3.3V  (via drill 0.3)
  Top 0.203: U1.30 8.63,35.95 C9.1 8.26,36.38 8.91,37.03 v8.97,37.03 | C12.1 7.1,31.75 U1.38 8.81,31.75 v8.94,31.88 | C21.1 9.83,27.14 U1.49 9.83,28.75 9.47,29.11 v9.47,29.16 | U1.1 15.25,28.95 16.01,28.19 C14.1 16.01,27.44 v15.49,26.92 14.61,26.04 13.51,26.04 12.78,26.76 C16.1 12.78,26.87 11.83,27.81 | U1.11 15.95,32.95 C15.1 16.54,32.36 17.76,32.36 v18.03,32.64 | C8.1 12.63,35.99 U1.20 12.63,34.65 v12.32,34.34 | U1.53 11.43,27.96 11.58,27.81 11.83,27.81 | U1.54 11.83,27.81 | v5.21,26.04 R18.2 | R13.2 v17.02,25.4 | v5.8,29.68 6.25,29.68 6.85,29.08 C17.1 U1.45 | R12.2 18.16,15.62 v17.78,15.62 | D2.A 17.28,4.58 v17.27,4.57 | C26.1 11.93,19.68 12.18,19.93 U11.8 12.5,20.34 12.7,20.14 v12.83,20.14
  Bottom 0.203: Q1.2 15.74,48.76 v15.88,48.9 | R8.2 6.99,18.92 v6.99,22.48 7.49,22.98 C11.1 | C11.1 U5.8 | C11.1 C10.1 | R23.2 12.31,26.54 14.5,28.73 | LP.2 16.51,22.87 17.02,23.38 v17.02,25.4
  Bottom 0.508: v15.49,26.92 15.49,27.74 14.5,28.73 v14.02,29.21 | v8.97,37.03 8.97,37.05 9.38,37.47 10.03,37.47 12.32,35.18 | 12.32,35.18 v12.32,34.34 | 12.32,35.18 16.89,39.75 v16.89,40.01 v16.89,40.77
  other vias: 15.16,16.26 14.63,16.26
  pour Route15 (isolate 0.178, rank 2): 0,0 22.86,0 22.86,53.59 0,53.59
  pour Top (isolate 0.203, no thermals): 16.64,40.89 16.64,39.88 16.76,39.75 17.14,39.75 17.27,39.88 18.03,39.88 18.03,40.89 17.27,40.89 17.14,41.02 16.76,41.02
  pour Bottom (isolate 0.203, no thermals): 14.55,16.43 14.15,16.03 14.15,15.57 14.33,15.39 15.67,15.39 16.08,15.8 16.08,16.18 15.82,16.43
3.3V_SW  (via drill 0.3)
  Top 0.203: U7.VCC 6.16,34.54 5.46,34.54 v4.95,35.05 4.45,35.56 C25.1
  Top 0.508: J3.2 5.66,9.39 6.22,9.95 v6.22,10.67 v6.22,11.18 | v14.86,14.22 v14.86,14.73 15.05,14.92 U9.5 15.9,16.36 C24.1
  Route15 0.203: v4.19,30.48 4.19,23.75 6.99,20.95 6.99,19.94 10.16,16.76 v10.16,13.97
  Bottom 0.203: v6.22,10.67 4.45,8.89 I2C.2 | v4.95,35.05 5.59,34.42 5.59,32.13 5.33,31.88 4.83,31.88 4.19,31.24 v4.19,30.48
  Bottom 0.305: 8.64,11.18 8.64,8 8.76,7.87 8.76,6.6 9.02,6.35 10.71,6.35 11.16,6.81 J6.4
  Bottom 0.508: v6.22,10.67 v6.22,11.18 8.64,11.18 10.16,12.7 v10.16,13.97 10.41,14.22 v14.86,14.22 v14.86,14.73
!BATT_ALERT!  (via drill 0.3)
  Top 0.203: U1.19 13.03,34.09 v12.9,33.96 | v6.17,8.08 6.82,8.08 6.87,8.03 U8.5
  Route15 0.203: v9.27,10.29 8.38,10.29 v6.17,8.08
  Bottom 0.203: v12.9,33.96 13.74,34.8 14.22,34.8 15.88,33.15 15.88,30.1 17.02,28.96 17.02,27.69 18.29,26.42 18.29,13.08 17.02,11.81 14.1,11.81 13.84,12.06 12.06,12.06 10.29,10.29 v9.27,10.29
!BOOT!  (via drill 0.3)
  Top 0.203: BOOT.4 BOOT.3 15.71,11.6 14.86,12.45 v14.86,12.95
  Bottom 0.203: v14.86,12.95 15.24,12.95 16.76,14.48 16.76,17.53 16.51,17.78 TP1.1 15.24,20.32 15.24,23.5 15.75,24 R14.2
!RESET!  (via drill 0.3)
  Top 0.203: U1.26 10.23,34.6 v10.59,34.24 | v17.78,17.78 19.54,16.02 R12.1 20.32,15.24 J1.28 21.59,11.74 RESET.4 RESET.3
  Bottom 0.203: v10.59,34.24 10.59,33.35 10.92,33.02 13.99,33.02 14.73,32.28 14.73,29.97 16,28.7 16,27.43 17.53,25.91 17.53,20.7 17.27,20.45 17.27,19.94 17.78,19.43 v17.78,17.78
BAT_SW  (via drill 0.3)
  Route15 0.203: v6.35,20.32 3.43,23.24 v3.43,30.48
  Bottom 0.203: U4.8 6.25,17.66 6.49,17.91 R8.1 6.49,18.91 6.35,19.05 v6.35,20.32 | v3.43,30.48 3.43,30.99 4.57,32.13 4.57,33.66 4.06,34.16 4.06,37.59 4.57,38.1 4.57,41.15 5.84,42.42 5.84,49.15 6.1,49.4 6.82,49.4 8.14,48.09 Q1.1
EN  (via drill 0.3)
  Top 0.203: v7.62,21.34 5.33,21.34 3.81,22.86 3.81,24.13 J1.11
  Bottom 0.203: U3.3 11.65,17.46 11.46,17.65 10.16,17.65 R7.2 8.26,18.29 8.26,18.92 7.62,19.56 v7.62,21.34
GND  (via drill 0.3)
  Top 0.203: U2.A7 4.91,43.94 5.46,43.94 5.97,44.45 v7.87,44.45 | U8.6 7.37,8.64 U8.9 | U8.9 7.87,8.89 8.37,9.39 U8.1 | C23.2 7.12,10.57 6.89,10.34 6.89,9.9 U8.4 6.87,9.39 7.37,8.89 U8.9 | J4.GND2 14.92,5.74 14.92,4.45 v14.95,4.42 | J4.GND 7.94,5.74 7.94,4.45 v7.91,4.42 | U1.EPAD v10.79,32.38 | v5.08,31.37 5.59,31.88 5.72,31.88 C12.2 | 12.47,13.97 12.47,12.62 12.63,12.47 13.21,12.47 | U9.2 12.47,13.97 | v11.43,24.13 11.43,23.75 10.68,23 U11.4 10.68,22.36 10.41,22.1 10.41,21.84 10.67,21.59 U11.9 12.45,21.59 12.7,21.34 v12.7,20.95 | C15.2 17.52,33.4 v17.78,33.4 | C16.2 13.22,25.4 v13.97,25.4 | v14.99,18.16 13.66,18.16 13.34,17.84 C13.2 12.88,17.39 12.47,16.98 12.47,13.97
  Top 0.305: v4.99,11.41 5.39,11.81 6.74,11.81 C23.2 7.62,11.93 7.62,12.19 | U10.2 v11.43,10.41
  Top 0.508: C8.2 v14.35,36.2 14.46,36.08 C3.1
  Route2 0.203: 9.36,29.76 8.93,29.34 | 9.4,31.37 8.51,31.37
  Bottom 0.203: 15.98,14.33 16.4,14.75 16.4,16.49 C2.2 15.75,16.89 14.2,16.89 v14.05,16.74 | v10.79,31.11 10.62,31.11 8.55,29.04 5.04,29.04 v4.95,28.96 | 9.27,31.37 8.38,31.37
  Bottom 0.508: U3.2 11.56,16.51 11.05,17.02 C1.2
  other vias: 12.06,32.38 12.06,31.11 11.28,26.21 9.63,36.78 5.08,42.55 18.29,31.11 12.04,37.52 8.13,26.92 7.62,26.42 6.73,25.65 6.99,53.34 8.26,53.34 9.53,53.34 10.79,53.34 12.06,53.34 13.34,53.34 14.61,53.34 15.88,53.34 2.54,53.34 20.32,53.34 2.54,48.26 18.16,42.8 17.78,14.86 5.08,30.73 4.95,27.94 4.95,37.08 17.78,27.81 6.11,8.89 3.81,18.92 9.57,9.5 14.35,8.76 14.22,12.45 5.97,13.59 10.41,18.16 2.54,30.48 16.26,45.72 18.8,39.37 16.26,8.89 18.41,0.64 22.23,4.45 4.45,0.64 0.64,4.45 8.26,0.64 14.61,0.64 20.32,10.16 16.51,48.26 20.32,50.8 7.87,46.35 14.35,46.74 1.91,18.92 3.3,11.43 18.8,35.31 8.1,35.08 5.71,24.13 6.99,17.75 7.75,22.48
  pour Top (isolate 0.178, rank 2): 0,0 22.86,0 22.86,53.59 0,53.59
  pour Bottom (isolate 0.178, rank 2): 22.86,0 0,0 0,53.59 22.86,53.59
  pour Route2 (isolate 0.178, rank 2): 0,0 22.86,0 22.86,53.59 0,53.59
  pour Top (isolate 0.127, no thermals): 9.07,28.55 9.07,26.82 8.76,26.82 7.82,25.88 7.82,25.4 7.39,25.4 7.39,27.05 7.85,27.51 8.86,27.51 8.99,27.64 8.99,28.55
GPIO5  (via drill 0.3)
  Top 0.203: U1.8 15.37,31.75 15.62,32 17.91,32 18.29,32 v18.8,32.51
  Route15 0.203: v18.8,32.51 20.57,32.51 21.34,31.75 J1.21
GPIO11  (via drill 0.3)
  Top 0.203: U1.15 16.23,34.55 16.3,34.62 16.94,34.62 v17.14,34.42
  Route15 0.203: J1.20 17.27,34.29 v17.14,34.42
GPIO12  (via drill 0.3)
  Top 0.203: v17.78,34.8 17.39,35.19 U1.16
  Route15 0.203: J1.19 19.56,34.8 v17.78,34.8
GPIO16  (via drill 0.3)
  Top 0.203: U1.27 9.83,35.89 v9.63,36.09
  Route15 0.203: v9.63,36.09 9.63,35.46 9.5,35.33 9.5,34.14 9.17,33.81 2.56,33.81 2.03,33.27 2.03,32.51 J1.9
GPIO17  (via drill 0.3)
  Top 0.203: U1.28 9.43,34.7 9.04,34.31 v8.89,34.31
  Route15 0.203: v8.89,34.31 8.76,34.19 1.37,34.19 J1.8
GPIO18  (via drill 0.3)
  Top 0.203: U1.29 9.03,36.28 v8.97,36.35
  Route15 0.203: J1.7 3.56,34.54 8.38,34.54 8.97,35.13 v8.97,36.35
GPIO19
  Top 0.203: U1.31 7.1,34.55 6.72,34.17 3.3,34.17 2.54,34.92 2.54,38.1 J1.6
GPIO20  (via drill 0.3)
  Top 0.203: v2.54,32.77 2.54,33.53 2.78,33.77 6.85,33.77 7.23,34.15 U1.32
  Bottom 0.203: v2.54,32.77 2.54,40.64 J1.5
GPIO21  (via drill 0.3)
  Top 0.203: v3.05,33.25 3.17,33.37 6.98,33.37 7.36,33.75 U1.33
  Bottom 0.203: v3.05,33.25 2.92,33.38 2.92,42.8 J1.4
GPIO22  (via drill 0.3)
  Top 0.203: U1.34 7.49,33.35 7.1,32.97 3.76,32.97 v3.56,32.77
  Bottom 0.203: v3.56,32.77 3.56,33.53 3.3,33.78 3.3,44.96 J1.3
GPIO26/A0  (via drill 0.3)
  Top 0.203: U1.40 8.78,30.95 v8.89,30.84
  Route15 0.203: v8.89,30.84 8.38,30.33 8.38,29.95 8.74,29.59 9.14,29.59 9.25,29.69 9.7,29.69 11.46,27.94 16.13,27.94 17.4,26.67 19.05,26.67 J1.24
GPIO27/A1  (via drill 0.3)
  Top 0.203: U1.41 8.44,30.55 8.84,30.15 v8.94,30.15
  Route15 0.203: v8.94,30.15 9.73,30.15 11.56,28.32 19.94,28.32 J1.23
GPIO28/A2  (via drill 0.3)
  Top 0.203: U1.42 7.18,30.15 v7.07,30.26
  Route15 0.203: v7.07,30.26 8.18,31.37 9.27,31.37 9.53,31.11 9.53,30.84 11.66,28.7 19.81,28.7 20.32,29.21 J1.22
LED_IN  (via drill 0.3)
  Top 0.203: U7.DI 4.95,36.13 v4.95,36.2 | U1.18 13.43,33.76 v13.56,33.64
  Route15 0.203: v13.56,33.64 13.35,33.43 12.41,33.43 11.81,34.04 11.81,36.32 10.29,37.85 6.6,37.85 v4.95,36.2
LED_OUT  (via drill 0.3)
  Top 0.203: U7.DO 6.73,36.94 6.73,36.58 v6.48,36.32
  Bottom 0.203: v6.48,36.32 6.48,40.77 7.37,41.66 7.37,46.61 8.25,47.49 17.01,47.49 19.05,49.53 19.05,50.8 20.32,52.07 J1.13
N$1
  Top 0.508: U2.C2 16.77,45.22 15.93,44.38 U2.B7 15.93,40.45 FB1.2
N$2
  Top 0.203: U2.A6 4.17,45.22 3.43,44.47 3.43,41.51 R1.1
N$3
  Top 0.203: R2.1 6.1,42.15 6.1,43.56 6.35,43.81 9.04,43.81 9.93,42.92 U2.B3
N$4
  Top 0.203: R19.2 5.96,38.1 D4.C
N$5
  Top 0.203: J4.B5 13.18,7.21 R3.2
N$6
  Top 0.203: J4.A5 10.18,6.71 R4.2
N$7
  Top 0.233: R11.1 10.9,13.83 10.9,12.27 10.48,11.86 U10.6 | J4.A7 11.68,5.46 11.43,5.21 10.92,5.21 10.68,5.45 J4.B7 10.68,6.74 11.16,7.22 11.16,7.72 10.48,8.4 U10.1
  Top 0.508: U10.1 U10.6
N$8
  Top 0.233: R10.1 11.96,13.83 11.96,12.27 12.38,11.86 U10.4 | J4.A6 11.18,6.61 11.68,7.11 | J4.B6 12.18,6.62 11.68,7.11 | 11.68,7.11 11.68,7.71 12.38,8.4 U10.3
  Top 0.508: U10.3 U10.4
N$9
  Bottom 0.203: I2C.3 2.26,7.85 2.54,8.13 R5.2
N$10
  Bottom 0.203: I2C.1 2.26,9.93 2.54,9.65 R6.2
N$11  (via drill 0.3)
  Top 0.203: v16.13,20.32 15.88,20.07 R21.2
  Bottom 0.203: LP.1 16.13,20.69 v16.13,20.32
N$13
  Top 0.203: U1.21 12.23,36.49 12.57,36.83 14.61,36.83 C3.2 15.44,36.5 15.78,36.5 Y1.P3
N$14
  Top 0.203: Y1.P1 17.36,38.03 17.36,38.54 C4.1 15.86,38.73 14.84,37.72 14.08,37.72 R9.1
N$15
  Top 0.203: U1.22 11.83,36.57 12.72,37.47 R9.2
N$18
  Top 0.203: R15.2 D2.C
N$19  (via drill 0.3)
  Top 0.203: R15.1 21.59,5.96 v21.59,5.08
  Bottom 0.203: PWR.2 v21.59,5.08
N$20
  Bottom 0.203: R16.2 2.86,14.79 U6.5
N$21  (via drill 0.3)
  Top 0.203: v3.3,12.19 3.81,12.7 D3.A
  Bottom 0.203: R17.1 3.18,12.19 v3.3,12.19
N$22  (via drill 0.3)
  Top 0.203: D3.C 8.5,13.46 7.74,14.22 5.59,14.22 5.21,14.61 5.21,14.99 2.41,17.78 v1.91,17.78
  Bottom 0.203: U6.1 1.94,17.81 v1.91,17.78
N$23
  pour Top (isolate 0.127, no thermals): 8.94,25.7 9.78,25.7 9.78,26.29 9.47,26.59 9.47,28.32 9.4,28.32 9.4,26.67 8.94,26.21
PERIPH_POW  (via drill 0.3)
  Top 0.203: U9.3 14.19,13.02 14.7,13.53 15.05,13.53 15.49,13.97 16.51,13.97 17.14,14.61 R22.2 16.51,18.55 | 16.51,18.55 R21.1 | 16.51,18.55 16.51,19.94 16.76,20.19 v17.78,20.19 | U1.17 13.83,34.43 v13.97,34.29
  Bottom 0.203: v17.78,20.19 17.91,20.32 17.91,26.16 16.45,27.62 16.45,28.89 15.24,30.1 15.24,33.02 v13.97,34.29
PICO  (via drill 0.3)
  Top 0.203: J1.17 19.81,40.13 19.81,31.75 18.48,30.42 v17.91,30.42 15.88,30.42 15.76,30.55 U1.5
  Bottom 0.203: J6.3 10.41,7.49 13.59,10.67 17.78,10.67 19.43,12.32 19.43,28.32 17.91,29.84 v17.91,30.42
POCI  (via drill 0.3)
  Top 0.203: J1.16 19.3,42.16 19.3,32.13 v18.92,31.75 18.8,31.62 15.75,31.62 15.47,31.35 U1.7
  Bottom 0.203: J6.7 14.81,8.46 16.26,9.91 18.29,9.91 20.19,11.81 20.19,29.08 18.92,30.35 v18.92,31.75
PSRAM_!CS!  (via drill 0.3)
  Top 0.203: U1.12 14.43,33.35 v13.59,32.51 | U11.1 12.18,23.51 v12.06,23.62
  Bottom 0.203: v13.59,32.51 14.22,31.88 14.22,30.18 13.51,29.46 13.51,28.5 11.81,26.8 11.81,25.9 R23.1 12.06,24.65 v12.06,23.62
QSPI_!CS!  (via drill 0.3)
  Top 0.203: U1.60 14.23,27.55 v14.73,27.05 | R14.1 14.99,25.16 v14.99,24.64
  Bottom 0.203: U5.1 14.33,23.5 14.99,24.15 v14.99,24.64 14.99,25.16 R14.1 14.73,25.42 v14.73,27.05
QSPI_CLK  (via drill 0.3)
  Top 0.203: U1.56 12.63,28.98 12.19,29.41 v12.19,29.59 | U11.6 11.18,20.57 10.92,20.83 10.03,20.83 v9.53,21.34
  Bottom 0.203: v12.19,29.59 12.19,28.45 10.05,26.31 10.05,21.86 v9.53,21.34 9.4,21.21 9.14,21.21 8.89,20.95 U5.6
QSPI_D0  (via drill 0.3)
  Top 0.203: v12.88,29.46 13.03,29.31 U1.57 | U11.5 9.54,20.34 v9.53,20.32
  Bottom 0.203: v12.88,29.46 12.88,28.63 10.56,26.31 10.56,21.36 v9.53,20.32 8.89,19.68 U5.5
QSPI_D1  (via drill 0.3)
  Top 0.203: U1.59 13.83,27.32 14.22,26.92 v14.22,26.54 | U11.2 11.68,22.61 11.94,22.35 12.95,22.35 v13.46,22.86
  Bottom 0.203: v14.22,26.54 13.46,25.78 v13.46,22.86 14.1,22.23 U5.2
QSPI_D2  (via drill 0.3)
  Top 0.203: U11.3 11.18,22.48 11.68,21.97 12.83,21.97 v12.95,21.84 | U1.58 13.43,26.87 v13.55,26.75
  Bottom 0.203: U5.3 14.08,20.95 13.57,21.46 13.34,21.46 v12.95,21.84 12.95,26.16 v13.55,26.75
QSPI_D3  (via drill 0.3)
  Top 0.203: U1.55 12.23,28.77 11.51,29.49 v11.51,29.59 | U11.7 11.68,20.7 11.18,21.21 10.54,21.21 v9.53,22.23
  Bottom 0.203: v11.51,29.59 11.51,28.27 9.54,26.31 9.54,22.24 v9.53,22.23 U5.7
RX  (via drill 0.3)
  Top 0.203: U1.3 15.5,29.75 15.88,29.37 18.83,29.37 v20.32,30.86
  Bottom 0.203: v20.32,30.86 20.32,45.72 J1.15
SCK  (via drill 0.3)
  Top 0.203: U1.4 15.63,30.15 15.88,29.9 v18.59,29.9 20.32,31.62 20.32,38.1 J1.18
  Bottom 0.203: J6.5 12.62,7.92 14.99,10.29 18.03,10.29 19.81,12.06 19.81,28.68 v18.59,29.9
SCL  (via drill 0.3)
  Top 0.203: U1.10 14.36,32.55 v13.59,31.77 | U8.7 7.87,7.57 7.57,7.26 6.22,7.26 6.1,7.39 J3.4 v5.08,6.6 | v2.29,10.67 2.29,7.24 v3.17,6.35
  Route15 0.203: J1.2 2.54,49.53 4.45,47.62 7.87,47.62 15.49,40.01 15.49,35.53 14.81,34.85 14.81,32.69 13.89,31.77 v13.59,31.77
  Bottom 0.203: v5.08,6.6 4.33,6.6 3.81,7.13 R5.1 v3.17,6.35 | v13.59,31.77 13.49,31.77 12.19,30.48 10.92,30.48 10.54,30.1 10.54,29.21 9.91,28.57 6.35,28.57 3.81,26.04 3.81,22.23 0.76,19.18 0.76,12.19 v2.29,10.67
SD_!CS!  (via drill 0.3)
  Top 0.203: v17.02,33.66 16.89,33.53 16.26,33.53 16.03,33.75 U1.13
  Bottom 0.203: v17.02,33.66 17.02,30.23 19.05,28.19 19.05,12.57 17.53,11.05 12.88,11.05 9.31,7.48 J6.2
SD_DET  (via drill 0.3)
  Top 0.203: v13.59,11.56 v13.59,9.91 | v16.51,34.12 16.48,34.15 U1.14
  Bottom 0.203: J6.9 11.87,8.18 v13.59,9.91 | v13.59,11.56 13.72,11.43 17.27,11.43 18.67,12.83 18.67,27.94 16.51,30.1 v16.51,34.12
SDA  (via drill 0.3)
  Top 0.203: U1.9 14.44,32.15 14.18,31.9 14.18,31.43 13.82,31.06 v13.59,31.06 | U8.8 8.37,7.56 7.67,6.86 6.1,6.86 5.33,6.1 4.83,6.1 4.06,6.86 4.06,7.75 4.71,8.39 J3.3 4.69,8.39 3.94,9.14 v3.94,9.53
  Route15 0.203: J1.1 5.08,48.26 8,48.26 15.94,40.32 15.94,35.24 15.3,34.61 15.3,32.45 13.92,31.06 v13.59,31.06
  Bottom 0.203: v3.94,9.53 3.94,9.89 R6.1 1.27,12.56 1.27,19.05 4.32,22.1 4.32,25.91 6.6,28.19 10.16,28.19 10.99,29.02 10.99,29.91 11.18,30.1 12.62,30.1 v13.59,31.06
SHLD
  Bottom 0.203: J4.SHLD3 7.13,1.27 SHLD.2
  pour Route2 (isolate 0.203): 7.11,5.59 7.11,1.14 15.75,1.14 15.75,5.59
SWCLK
  Top 0.203: U1.24 11.03,35.71 10.67,36.07 10.67,37.85 10.92,38.1 12.7,38.1 J5.1
SWDIO
  Top 0.203: J5.3 10.25,38.01 10.25,36 10.63,35.62 U1.25
TX  (via drill 0.3)
  Top 0.203: U1.2 15.37,29.35 15.76,28.97 19.19,28.97 v20.32,30.1
  Bottom 0.203: v20.32,30.1 19.81,30.61 19.81,47.75 J1.14
USB_D_N
  Top 0.233: U1.51 10.63,27.75 11.81,26.57 11.81,25.27 13.08,24 13.72,24 14.48,23.24 14.48,20.07 11.25,16.84 11.25,15.18 R11.2
USB_D_P
  Top 0.233: U1.52 11.03,27.86 12.17,26.72 12.17,25.42 13.23,24.36 13.87,24.36 14.84,23.39 14.84,19.92 11.61,16.69 11.61,15.18 R10.2
V_BATT  (via drill 0.3)
  Top 0.203: U8.3 7.37,10.16 7.62,10.41 | 7.62,10.41 7.87,10.16 U8.2 | 7.62,10.41 8.12,10.91 C23.1 8.76,11.43 9.26,11.94 9.26,13.34 8.64,13.97 v8.64,15.75
  Top 0.508: J2.2 4.9,18.78 v4.76,18.92 4.76,16.2 5.21,15.75 v8.64,15.75
  Route15 0.508: J1.12 1.27,22.41 v4.76,18.92 7.93,15.75 v8.64,15.75
  Bottom 0.305: U4.3 8.38,16.26 8.64,16 v8.64,15.75
  Bottom 0.508: U6.3 v4.76,18.92 4.76,19.23 C6.1
V_USB  (via drill 0.3)
  Top 0.305: U10.5 v11.43,12.7
  Route15 0.508: J1.10 2.54,27.94 2.54,22.86 6.35,19.05 6.73,19.05 9.4,16.38 9.4,14.73 | 9.4,14.73 v5.84,14.73 | 9.4,14.73 9.4,13.46 10.16,12.7 v11.43,12.7 11.43,11.43 10.41,10.41 10.41,9.14 9.4,8.13 v9.4,4.95 9.65,4.7 v10.54,4.7 v12.32,4.7 13.21,4.7 v13.46,4.95
  Bottom 0.203: R17.2 2.16,14.22 2.16,15.88 2.54,16.26 4.06,16.26 4.76,15.56 U6.4
  Bottom 0.305: U6.4 4.76,15.46 5.56,16.26 U4.6
  Bottom 0.508: U6.4 4.76,14.15 C5.1 5.84,14.6 v5.84,14.73
  pour Top (isolate 0.203, no thermals): 8.76,6.35 8.76,5.21 9.53,4.45 13.34,4.45 14.1,5.21 14.1,6.35
VDDA  (via drill 0.3)
  Top 0.203: R18.1 C22.1 7.03,27.64 v7.75,27.64 8.33,27.64 8.63,27.93 U1.46 8.63,28.75 8.66,28.78 8.66,29.12 8.43,29.35 U1.44
  Route15 0.203: v7.75,27.64 8.94,27.64 9.02,27.56 15.88,27.56 17.65,25.78 17.65,22.99 J1.26
VIN  (via drill 0.3)
  Top 0.508: U9.1 13.3,15.4 v13.08,15.62 13.34,15.88 C13.1
  Bottom 0.305: U4.7 U4.2 8.78,16.76 R7.1
  Bottom 0.508: R7.1 C1.1 11.25,15.56 U3.1 13.02,15.56 v13.08,15.62
WL_CLK  (via drill 0.3)
  Top 0.203: U2.A3 6.04,49.72 6.35,49.4 v6.35,48.9 | v6.35,30.23 6.83,29.75 U1.43
  Bottom 0.203: v6.35,48.9 6.86,48.39 6.86,41.91 5.97,41.02 5.97,35.94 6.35,35.56 6.35,34.42 6.99,33.78 6.99,31.62 6.35,30.99 v6.35,30.23
WL_CS  (via drill 0.3)
  Top 0.203: U2.B2 8.43,41.83 v7.49,40.89 | U1.37 8.48,32.15 8.91,32.59 v8.94,32.59
  Bottom 0.203: v8.94,32.59 8.91,32.59 6.99,34.52 6.99,40.39 v7.49,40.89
WL_D  (via drill 0.3)
  Top 0.203: U1.36 5.25,32.55 v5.08,32.38 | R1.2 R2.2 v5.08,39.37 | v6.35,46.61 6.24,46.72 U2.A5
  Bottom 0.203: v5.08,32.38 5.08,33.78 4.45,34.42 4.45,37.34 5.08,37.97 v5.08,39.37 5.08,40.89 6.35,42.16 v6.35,46.61
WL_GPIO0
  Top 0.203: D4.A 6.93,40.83 U2.B1
WL_GPIO2  (via drill 0.3)
  Top 0.203: U2.C3 16.28,46.72 v16.26,46.74
  Bottom 0.203: R20.2 Q1.3 16.05,46.94 v16.26,46.74
WL_ON  (via drill 0.3)
  Top 0.203: U2.B6 U2.B5 12.93,41 v12.83,40.89 | U1.35 8.57,32.95 8.91,33.3 v8.94,33.3
  Bottom 0.203: v12.83,40.89 8.51,40.89 7.59,39.98 7.59,34.65 v8.94,33.3

### Text on the board
Bottom: v11
tDocu: 4-layer / JLC7628 Stackup / Material: TG135-140 / 1oz outer layers / 0.5oz inner layers / Board thickness: 1.6mm / Soldermask: Red / Silkscreen: White / Surface Finish: Lead-Free HASL | Dryw Wade | Based on design by: Nathan Seidle